# EAGLE design placa_PM (EAGLE 9.6.2)
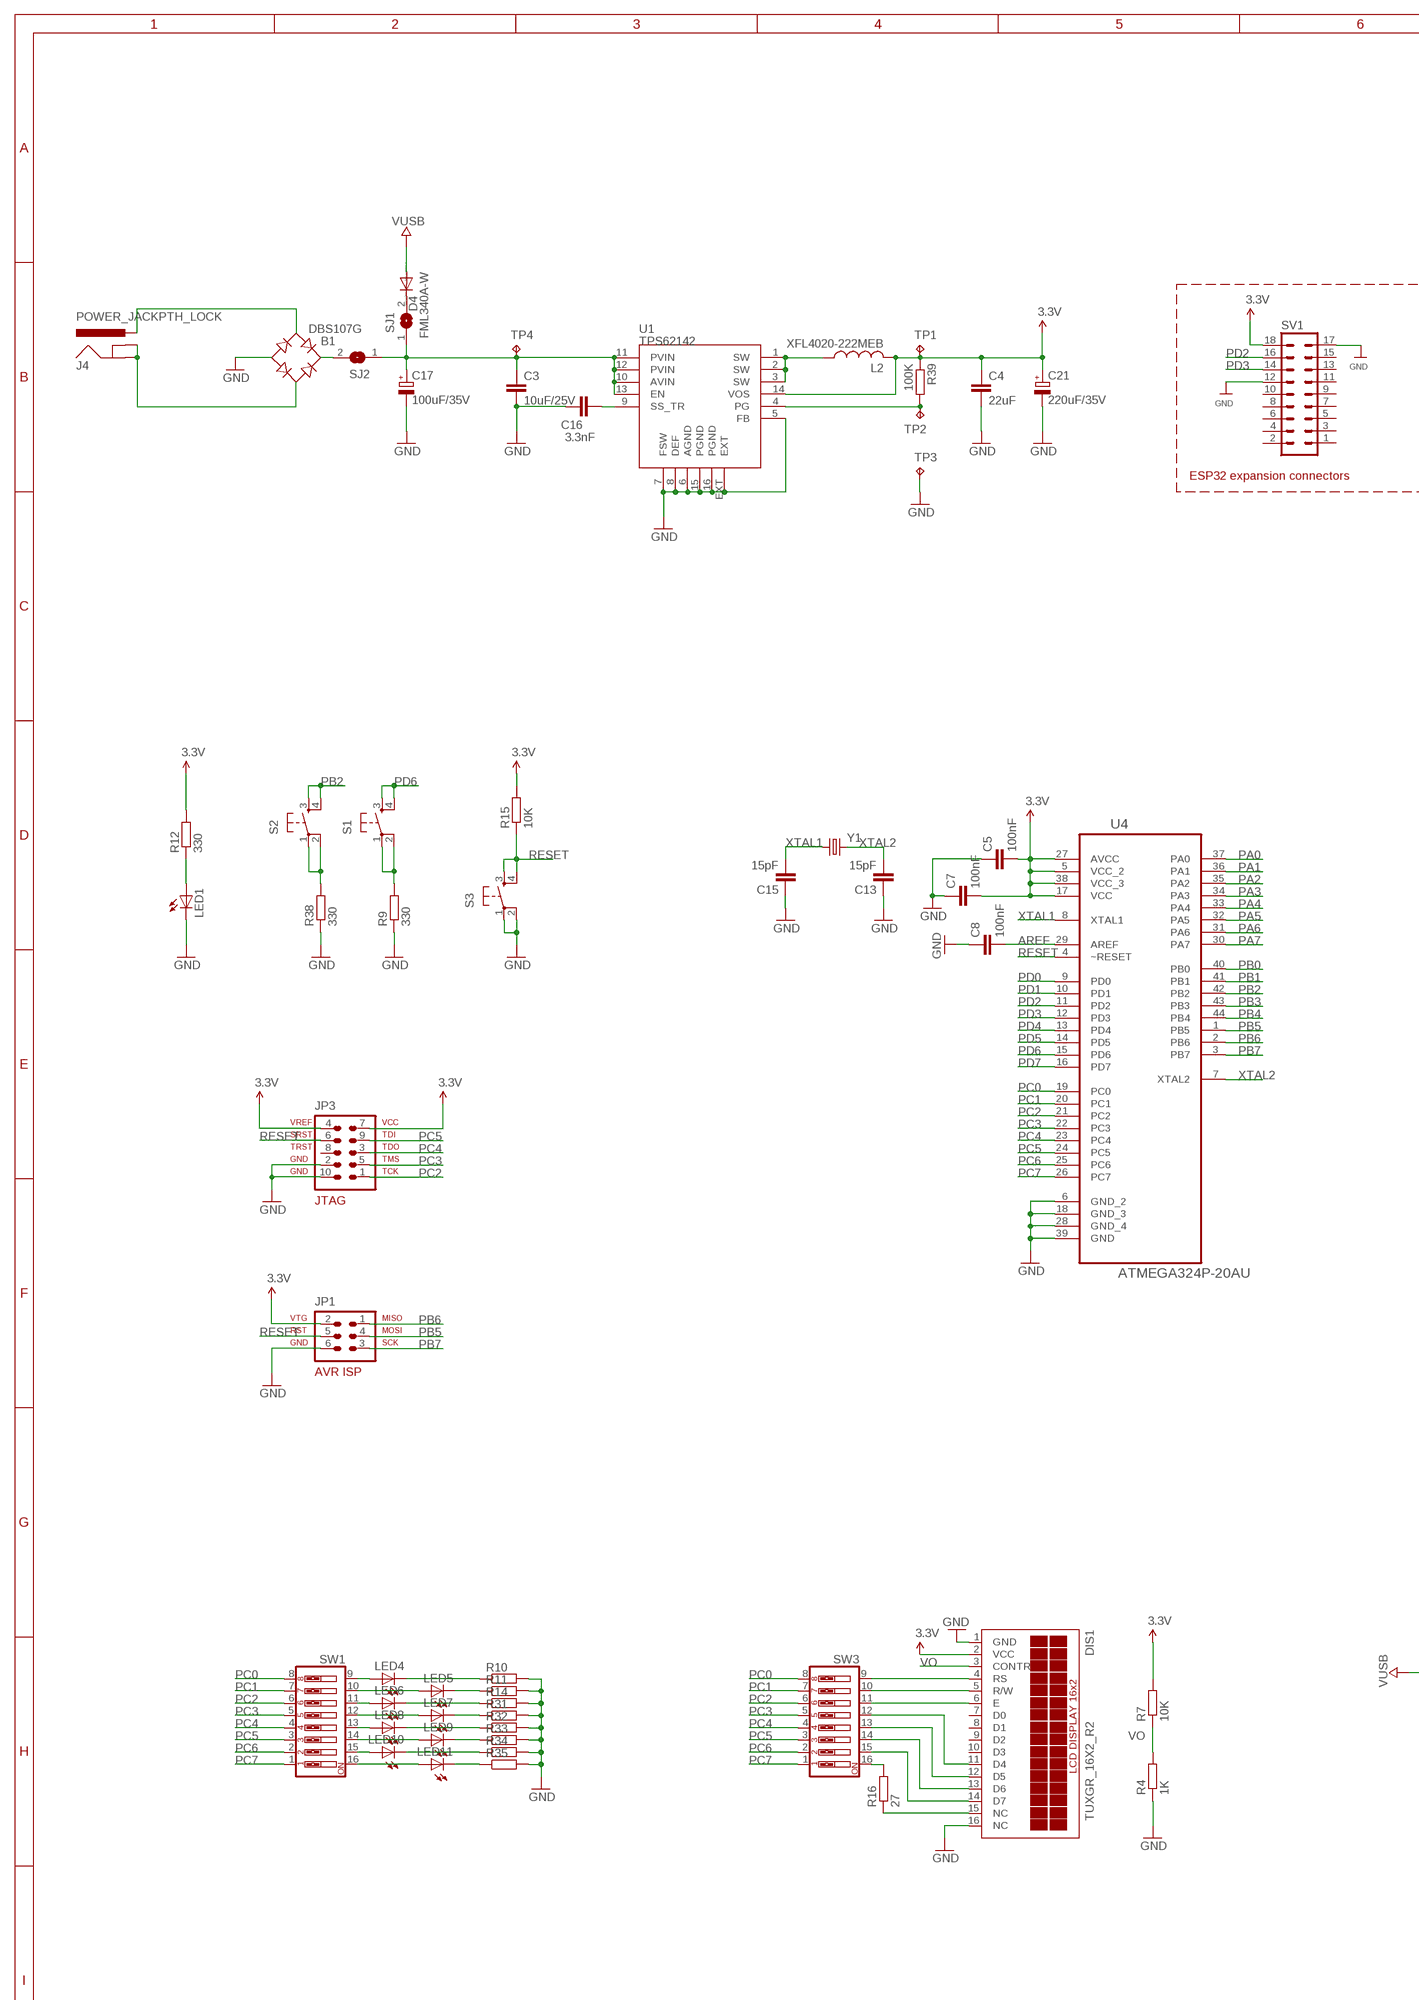
[diagram p0: schematic, sheet 1, part 1 of 2]
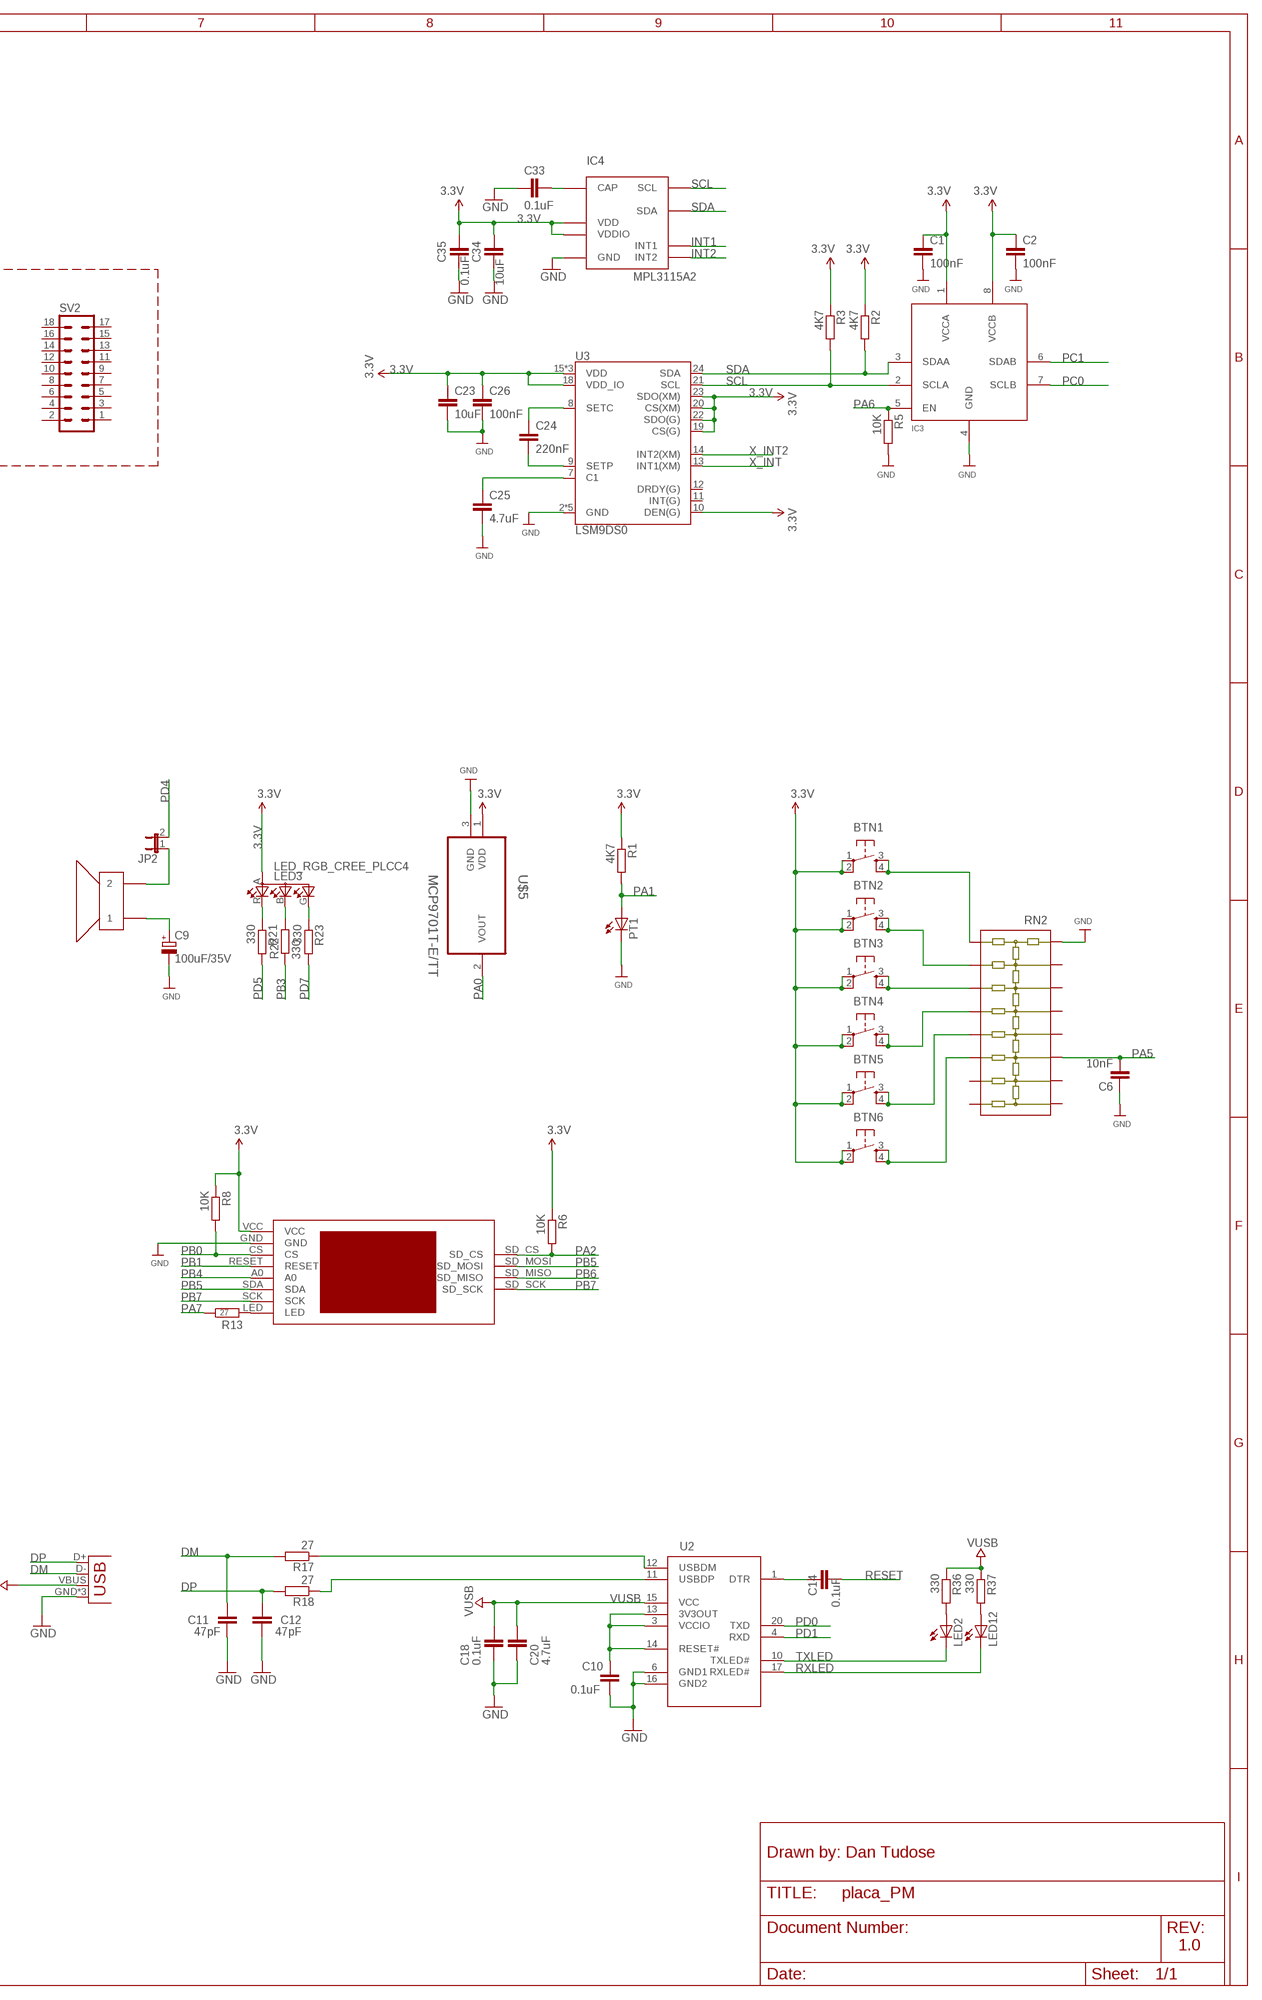
[diagram p1: schematic, sheet 1, part 2 of 2]

## Parts
B1  DBS107G  [DBS]
BTN1  TAC_SWITCHPTH  [TACTILE-PTH]
BTN2  TAC_SWITCHPTH  [TACTILE-PTH]
BTN3  TAC_SWITCHPTH  [TACTILE-PTH]
BTN4  TAC_SWITCHPTH  [TACTILE-PTH]
BTN5  TAC_SWITCHPTH  [TACTILE-PTH]
BTN6  TAC_SWITCHPTH  [TACTILE-PTH]
C1  100nF  C-EUC0402  [C0402]
C2  100nF  C-EUC0402  [C0402]
C3  10uF/25V  C-EUC1210  [C1210]
C4  22uF  C-EUC1206  [C1206]
C5  100nF  C-EUC0402  [C0402]
C6  10nF  C-EUC0402  [C0402]
C7  100nF  C-EUC0402  [C0402]
C8  100nF  C-EUC0402  [C0402]
C9  100uF/35V  CPOL-EUUD-6,3X7,7  [UD-6,3X7,7_NICHICON]
C10  0.1uF  C-EUC0402  [C0402]
C11  47pF  C-EUC0402  [C0402]
C12  47pF  C-EUC0402  [C0402]
C13  15pF  C-EUC0402  [C0402]
C14  0.1uF  C-EUC0402  [C0402]
C15  15pF  C-EUC0402  [C0402]
C16  3.3nF  C-EUC0603  [C0603]
C17  100uF/35V  CPOL-EUUD-6,3X7,7  [UD-6,3X7,7_NICHICON]
C18  0.1uF  C-EUC0402  [C0402]
C20  4.7uF  C-EUC0603  [C0603]
C21  220uF/35V  CPOL-EUUD-6,3X7,7  [UD-6,3X7,7_NICHICON]
C23  10uF  C-EUC0402  [C0402]
C24  220nF  C-EUC0402  [C0402]
C25  4.7uF  C-EUC0603  [C0603]
C26  100nF  C-EUC0402  [C0402]
C33  0.1uF  CAP0402-CAP  [0402-CAP]
C34  10uF  CAP0402-CAP  [0402-CAP]
C35  0.1uF  CAP0402-CAP  [0402-CAP]
D4  FML340A-W  DIODE-DO-214AC  [DO-214AC]
DIS1  TUXGR_16X2_R2  [TUXGR_16X2_R2]
IC3  TCA9803VSS  [VSSOP8]
IC4  MPL3115A2  [LGA8R125P0X4_500X300X120]
J3  USBPTH  [USB-B-PTH]
J4  POWER_JACKPTH_LOCK  [POWER_JACK_PTH_LOCK]
JP1  AVR-ISP-6  [AVR-ISP-6]
JP2  JP1E  [JP1]
JP3  AVR-JTAG-10  [AVR-JTAG-10]
L2  XFL4020-222MEB  XFL4020  [XFL4020]
LED1  LEDCHIPLED_0603  [CHIPLED_0603]
LED2  LEDCHIP-LED0603  [CHIP-LED0603]
LED3  LED_RGB_CREE_PLCC4  [P-LCC-4-4]
LED4  LEDCHIP-LED0603  [CHIP-LED0603]
LED5  LEDCHIP-LED0603  [CHIP-LED0603]
LED6  LEDCHIP-LED0603  [CHIP-LED0603]
LED7  LEDCHIP-LED0603  [CHIP-LED0603]
LED8  LEDCHIP-LED0603  [CHIP-LED0603]
LED9  LEDCHIP-LED0603  [CHIP-LED0603]
LED10  LEDCHIP-LED0603  [CHIP-LED0603]
LED11  LEDCHIP-LED0603  [CHIP-LED0603]
LED12  LEDCHIP-LED0603  [CHIP-LED0603]
PT1  LEDSML0805  [SML0805]
R1  4K7  R-EU_R0402  [R0402]
R2  4K7  R-EU_R0402  [R0402]
R3  4K7  R-EU_R0402  [R0402]
R4  1K  R-EU_R0402  [R0402]
R5  10K  R-EU_R0402  [R0402]
R6  10K  R-EU_R0402  [R0402]
R7  10K  R-EU_R0402  [R0402]
R8  10K  R-EU_R0402  [R0402]
R9  330  R-EU_R0402  [R0402]
R10  R-EU_R0402  [R0402]
R11  R-EU_R0402  [R0402]
R12  330  R-EU_R0402  [R0402]
R13  27  R-EU_R0603  [R0603]
R14  R-EU_R0402  [R0402]
R15  10K  R-EU_R0402  [R0402]
R16  27  R-EU_R0603  [R0603]
R17  27  R-EU_R0603  [R0603]
R18  27  R-EU_R0603  [R0603]
R21  330  R-EU_R0402  [R0402]
R22  330  R-EU_R0402  [R0402]
R23  330  R-EU_R0402  [R0402]
R31  R-EU_R0402  [R0402]
R32  R-EU_R0402  [R0402]
R33  R-EU_R0402  [R0402]
R34  R-EU_R0402  [R0402]
R35  R-EU_R0402  [R0402]
R36  330  R-EU_R0402  [R0402]
R37  330  R-EU_R0402  [R0402]
R38  330  R-EU_R0402  [R0402]
R39  100K  R-EU_R0402  [R0402]
RN2  4816P-R2R  [4816P]
S1  TAC_SWITCHPTH  [TACTILE-PTH]
S2  TAC_SWITCHPTH  [TACTILE-PTH]
S3  TAC_SWITCHPTH  [TACTILE-PTH]
SJ1  SJ  [SJ]
SJ2  SJ  [SJ]
SV1  MA09-2  [MA09-2]
SV2  MA09-2  [MA09-2]
SW1  SW_DIP-8  [EDG-08]
SW3  SW_DIP-8  [EDG-08]
TP1  TPB1,27  [B1,27]
TP2  TPB1,27  [B1,27]
TP3  TPB1,27  [B1,27]
TP4  TPB1,27  [B1,27]
U1  TPS62142  TPS6214X""  [QFN16-3X3MM_1:1_V03]
U2  FT231XS  [SSOP20]
U3  LSM9DS0  [LGA-24]
U4  ATMEGA324P-20AU  [QFP80P1200X1200X120-44N]
U$5  MCP9701T-E/TT  [SOT95P237X112-3N]
U$6  CVS-3108  SPEAKER  [SPK]
U$8  LCD128X160  [LCD128X160]
Y1  CRYSTAL5X3  [CRYSTAL-SMD-5X3]

## Nets
3.3V: BTN1.1 BTN1.2 BTN2.1 BTN2.2 BTN3.1 BTN3.2 BTN4.1 BTN4.2 BTN5.1 BTN5.2 BTN6.1 BTN6.2 C1.1 C2.1 C4.1 C5.2 C7.2 C21.+ C23.1 C26.1 C34.2 C35.2 DIS1.2(VCC) IC3.1(VCCA) IC3.8(VCCB) IC4.1(VDD) IC4.4(VDDIO) JP1.2 JP3.4 JP3.7 L2.P$2 LED3.A(A2) R1.1 R2.1 R3.1 R6.1 R7.2 R8.1 R12.2 R15.2 R39.1 SV1.18 TP1.TP U1.14(VOS) U3.10(DEN(G)) U3.15(VDD) U3.16(VDD) U3.17(VDD) U3.18(VDD_IO) U3.19(CS(G)) U3.20(CS(XM)) U3.22(SDO(G)) U3.23(SDO(XM)) U4.5(VCC_2) U4.17(VCC) U4.27(AVCC) U4.38(VCC_3) U$5.1(VDD) U$8.VCC
AREF: C8.2 U4.29(AREF)
DM: C11.2 J3.D- R17.2
DP: C12.2 J3.D+ R18.2
GND: B1.- C1.2 C2.2 C3.2 C4.2 C5.1 C6.1 C7.1 C8.1 C9.- C10.2 C11.1 C12.1 C13.1 C15.1 C16.1 C17.- C18.2 C20.2 C21.- C23.2 C25.2 C26.2 C33.1 C34.1 C35.1 DIS1.1(GND) DIS1.16(NC) IC3.4(GND) IC4.3(GND) J3.GND J3.P$1(GND) J3.P$2(GND) JP1.6 JP3.2 JP3.10 LED1.C PT1.C R4.1 R5.2 R9.1 R10.2 R11.2 R14.2 R31.2 R32.2 R33.2 R34.2 R35.2 R38.1 RN2.9 S3.1 S3.2 SV1.12 SV1.17 TP3.TP U1.5(FB) U1.6(AGND) U1.7(FSW) U1.8(DEF) U1.15(PGND) U1.16(PGND) U1.EXT U2.6(GND1) U2.16(GND2) U3.2(GND) U3.3(GND) U3.4(GND) U3.5(GND) U3.6(GND) U4.6(GND_2) U4.18(GND_3) U4.28(GND_4) U4.39(GND) U$5.3(GND) U$8.GND
INT1: IC4.6(INT1)
INT2: IC4.5(INT2)
N$1: BTN1.3 BTN1.4 RN2.8
N$2: LED1.A R12.1
N$3: JP2.1 U$6.P$2
N$4: BTN2.3 BTN2.4 RN2.7
N$5: DIS1.4(RS) SW3.9
N$6: C9.+ U$6.P$1
N$7: DIS1.5(R/W) SW3.10
N$8: DIS1.15(NC) R16.1
N$9: R38.2 S2.1 S2.2
N$10: D4.C SJ1.2
N$11: B1.AC1 J4.PWR
N$12: B1.AC2 J4.GND J4.GNDBREAK
N$13: C3.1 C17.+ SJ1.1 SJ2.1 TP4.TP U1.10(AVIN) U1.11(PVIN) U1.12(PVIN) U1.13(EN)
N$14: BTN3.3 BTN3.4 RN2.6
N$15: BTN4.3 BTN4.4 RN2.5
N$16: DIS1.6(E) SW3.11
N$17: R9.2 S1.1 S1.2
N$19: B1.+ SJ2.2
N$20: BTN5.3 BTN5.4 RN2.4
N$21: BTN6.3 BTN6.4 RN2.3
N$23: R13.2 U$8.LED
N$24: LED3.R(CRED) R21.1
N$25: LED3.B(CBLUE) R22.2
N$26: C14.1 U2.1(DTR)
N$27: C33.2 IC4.2(CAP)
N$28: LED3.G(CGREEN) R23.1
N$29: C24.1 U3.8(SETC)
N$30: C24.2 U3.9(SETP)
N$31: C25.1 U3.7(C1)
N$33: DIS1.11(D4) SW3.12
N$36: DIS1.12(D5) SW3.13
N$37: C16.2 U1.9(SS_TR)
N$38: DIS1.13(D6) SW3.14
N$39: DIS1.14(D7) SW3.15
N$40: R16.2 SW3.16
N$41: LED4.A SW1.9
N$42: LED6.A SW1.11
N$43: LED8.A SW1.13
N$44: LED10.A SW1.15
N$45: LED11.A SW1.16
N$46: LED9.A SW1.14
N$47: LED7.A SW1.12
N$48: LED5.A SW1.10
N$49: LED4.C R10.1
N$50: LED5.C R11.1
N$51: LED6.C R14.1
N$52: LED7.C R31.1
N$53: LED8.C R32.1
N$54: LED9.C R33.1
N$55: LED10.C R34.1
N$56: LED11.C R35.1
N$57: C10.1 U2.3(VCCIO) U2.13(3V3OUT) U2.14(RESET#)
N$58: R17.1 U2.12(USBDM)
N$59: R18.1 U2.11(USBDP)
N$60: LED2.A R36.2
N$61: LED12.A R37.2
N$65: L2.P$1 U1.1(SW) U1.2(SW) U1.3(SW)
N$67: R39.2 TP2.TP U1.4(PG)
PA0: U4.37(PA0) U$5.2(VOUT)
PA1: PT1.A R1.2 U4.36(PA1)
PA2: R6.2 U4.35(PA2) U$8.SD_CS
PA3: U4.34(PA3)
PA4: U4.33(PA4)
PA5: C6.2 RN2.14 U4.32(PA5)
PA6: IC3.5(EN) R5.1 U4.31(PA6)
PA7: R13.1 U4.30(PA7)
PB0: R8.2 U4.40(PB0) U$8.CS
PB1: U4.41(PB1) U$8.RESET
PB2: S2.3 S2.4 U4.42(PB2)
PB3: R22.1 U4.43(PB3)
PB4: U4.44(PB4) U$8.A0
PB5: JP1.4 U4.1(PB5) U$8.SD_MOSI U$8.SDA
PB6: JP1.1 U4.2(PB6) U$8.SD_MISO
PB7: JP1.3 U4.3(PB7) U$8.SCK U$8.SD_SCK
PC0: IC3.7(SCLB) SW1.8 SW3.8 U4.19(PC0)
PC1: IC3.6(SDAB) SW1.7 SW3.7 U4.20(PC1)
PC2: JP3.1 SW1.6 SW3.6 U4.21(PC2)
PC3: JP3.5 SW1.5 SW3.5 U4.22(PC3)
PC4: JP3.3 SW1.4 SW3.4 U4.23(PC4)
PC5: JP3.9 SW1.3 SW3.3 U4.24(PC5)
PC6: SW1.2 SW3.2 U4.25(PC6)
PC7: SW1.1 SW3.1 U4.26(PC7)
PD0: U2.20(TXD) U4.9(PD0)
PD1: U2.4(RXD) U4.10(PD1)
PD2: SV1.16 U4.11(PD2)
PD3: SV1.14 U4.12(PD3)
PD4: JP2.2 U4.13(PD4)
PD5: R21.2 U4.14(PD5)
PD6: S1.3 S1.4 U4.15(PD6)
PD7: R23.2 U4.16(PD7)
RESET: C14.2 JP1.5 JP3.6 R15.1 S3.3 S3.4 U4.4(~RESET)
RXLED: LED12.C U2.17(RXLED#)
SCL: IC3.2(SCLA) IC4.8(SCL) R3.2 U3.21(SCL)
SDA: IC3.3(SDAA) IC4.7(SDA) R2.2 U3.24(SDA)
TXLED: LED2.C U2.10(TXLED#)
VO: DIS1.3(CONTR) R4.2 R7.1
VUSB: C18.1 C20.1 D4.A J3.VBUS R36.1 R37.1 U2.15(VCC)
X_INT: U3.13(INT1(XM))
X_INT2: U3.14(INT2(XM))
XTAL1: C15.2 U4.8(XTAL1) Y1.1
XTAL2: C13.2 U4.7(XTAL2) Y1.3
Unconnected: DIS1.7(D0) DIS1.8(D1) DIS1.9(D2) DIS1.10(D3) JP3.8 RN2.1 RN2.2 RN2.10 RN2.11 RN2.12 RN2.13 RN2.15 RN2.16 SV1.1 SV1.2 SV1.3 SV1.4 SV1.5 SV1.6 SV1.7 SV1.8 SV1.9 SV1.10 SV1.11 SV1.13 SV1.15 SV2.1 SV2.2 SV2.3 SV2.4 SV2.5 SV2.6 SV2.7 SV2.8 SV2.9 SV2.10 SV2.11 SV2.12 SV2.13 SV2.14 SV2.15 SV2.16 SV2.17 SV2.18 U3.11(INT(G)) U3.12(DRDY(G))

## Notes on the sheet
- ESP32 expansion connectors
- Drawn by: Dan Tudose
- 1.0

## Library data of the parts
B1 = rectifier:DB?*G: Single Phase 1.0 AMP Glass Passivated Bridge Rectifier Taiwan Semiconductor Co.,Ltd. - TSC Source: http://www.taiwansemi.com/TSCbig5/ezcatfiles/cust/img/img/db101g.pdf http://www.ts.com.tw/db/pictures/modules/PDT/PDT060207001/DBLS201G.pdf
BTN1-BTN6 S1-S3 = SparkFun:TAC_SWITCH: Momentary Switch Button commonly used for reset or general input. Spark Fun Electronics SKU : COM-00097
C1 C2 C5-C8 C13 C15 C23-C26 = rcl@1:C-EU: CAPACITOR, European symbol
C3 = rcl:C-EU: CAPACITOR, European symbol; TYPE: TMK325BJ106KM-P
C4 C16 = rcl:C-EU: CAPACITOR, European symbol
C9 C17 C21 = rcl:CPOL-EU: POLARIZED CAPACITOR, European symbol; CODE: UUR1V101MCL6GS
C10-C12 C14 C18 C20 = resistor:C-EU: CAPACITOR, European symbol
C33-C35 = SparkFun-Passives:CAP: Capacitor Standard 0603 ceramic capacitor, and 0.1" leaded capacitor.
D4 = diode@1:DIODE-: DIODE
DIS1 = display-lcd:TUXGR_16X2_R2: Tuxgraphics LCD display 16x2 characters reflective, without background light Source: tuxgr_12x2_r2.pdf; OC_FARNELL: unknown; OC_NEWARK: unknown
IC3 = dan:TCA9803
IC4 = Freescale_By_element14_Batch_1:MPL3115A2
J3 = 0andrei_custom:USB: USB Connectors USB-B-PTH is fully proven SKU : PRT-00139 USB-miniB is fully proven SKU : PRT-00587 USB-A-PCB is untested. USB-A-H is throughly reviewed, but untested. Spark Fun Electronics SKU : PRT-00437 USB-B-SMT is throughly reviewed, but untested. Needs silkscreen touching up. USB-A-S has not been used/tested USB-MB-H has not been used/tested
J4 = SparkFun-Connectors:POWER_JACK: Power Jack This is the standard 5.5mm barrel jack for power. The PTH is the most common, proven, reliable, footprint. The Slot footprint only works if the mill layer is transmitted to the PCB fab house so be warned. Spark Fun Electronics SKU : PRT-00119 SMT: CONN-08106 Mating wall wart : TOL-00298 (and others)
JP1 = 0andrei_custom:AVR-ISP-6: AVR ISP-6 Serial Programming Header
JP2 = jumper:JP1E: JUMPER
JP3 = avr-7:AVR-JTAG-10: AVR JTAG Debug/Programming Header
L2 = XFL4020:XFL4020: Coilcraft shielded 4x4mm high temperature inductor
LED1 PT1 = led:LED: LED
LED2 LED4-LED12 = adafruit:LED: LED
LED3 = led:LED_RGB_CREE_PLCC4
R1-R3 R5 R6 R8 R21-R23 = rcl@1:R-EU_: RESISTOR, European symbol
R4 R7 R9 R12 R13 R15 R16 R38 R39 = 0andrei_custom:R-EU_: RESISTOR, European symbol
R10 R11 R14 R31-R35 = rcl:R-EU_: RESISTOR, European symbol
R17 R18 R36 R37 = resistor:R-EU_: RESISTOR, European symbol
RN2 = resistor-bourns:4816P-R2R
SJ1 SJ2 = jumper:SJ: SMD solder JUMPER
SV1 SV2 = con-lstb:MA09-2: PIN HEADER; OC_FARNELL: unknown; OC_NEWARK: unknown
SW1 SW3 = special:SW_DIP-8: DIP SWITCH
TP1-TP4 = testpad:TP: Test pad
U1 = SparkFun-PowerIC:TPS6214X: 3-17V, 2A Step Down Converter
U2 = 0andrei_custom:FT231XS
U3 = SparkFun-DigitalIC:LSM9DS0: LSM9DS0 3D Accelerometer, 3D Gyroscope, 3D Magnetomter Features: 3 acceleration channels, 3 angular rate channels, 3 magnetic field channels ±2/±4/±6/±8/±16 g linear acceleration full scale ±2/±4/±8/±12 gauss magnetic full scale ±245/±500/±2000 dps angular rate full scale 16-bit data output SPI / I2C serial interfaces Analog supply voltage 2.4 V to 3.6 V Power-down mode / low-power mode Programmable interrupt generators Embedded self-test Embedded temperature sensor Embedded FIFO Position and motion detection functions Click/double-click recognition
U4 = Atmel_By_element14_Batch_1-00:ATMEGA324P-20AU: 8-bit Microcontroller with 16K/32K/64K Bytes In-System Programmable Flash; MPN: ATMEGA324P-20AU; OC_FARNELL: 1455109; OC_NEWARK: 58M3735; PACKAGE: TQFP-44; SUPPLIER: Atmel
U$5 = Microchip_By_element14_Batch_1:MCP9701T-E/TT: Low-Power Linear Active Thermistor; MPN: MCP9701T-E/TT; OC_FARNELL: 1834865; OC_NEWARK: 58T3403; PACKAGE: SOT-3; SUPPLIER: MICROCHIP
U$6 = dan:SPEAKER
U$8 = dan:LCD128X160
Y1 = SparkFun-FreqCtrl:CRYSTAL: Various standard crystals. Proven footprints. Spark Fun Electronics SKU : COM-00534

## Net classes
1 power: width 0.61 mm
2 gnd: width 0.254 mm, drill 0.61 mm, clearance 0.254 mm

## Board
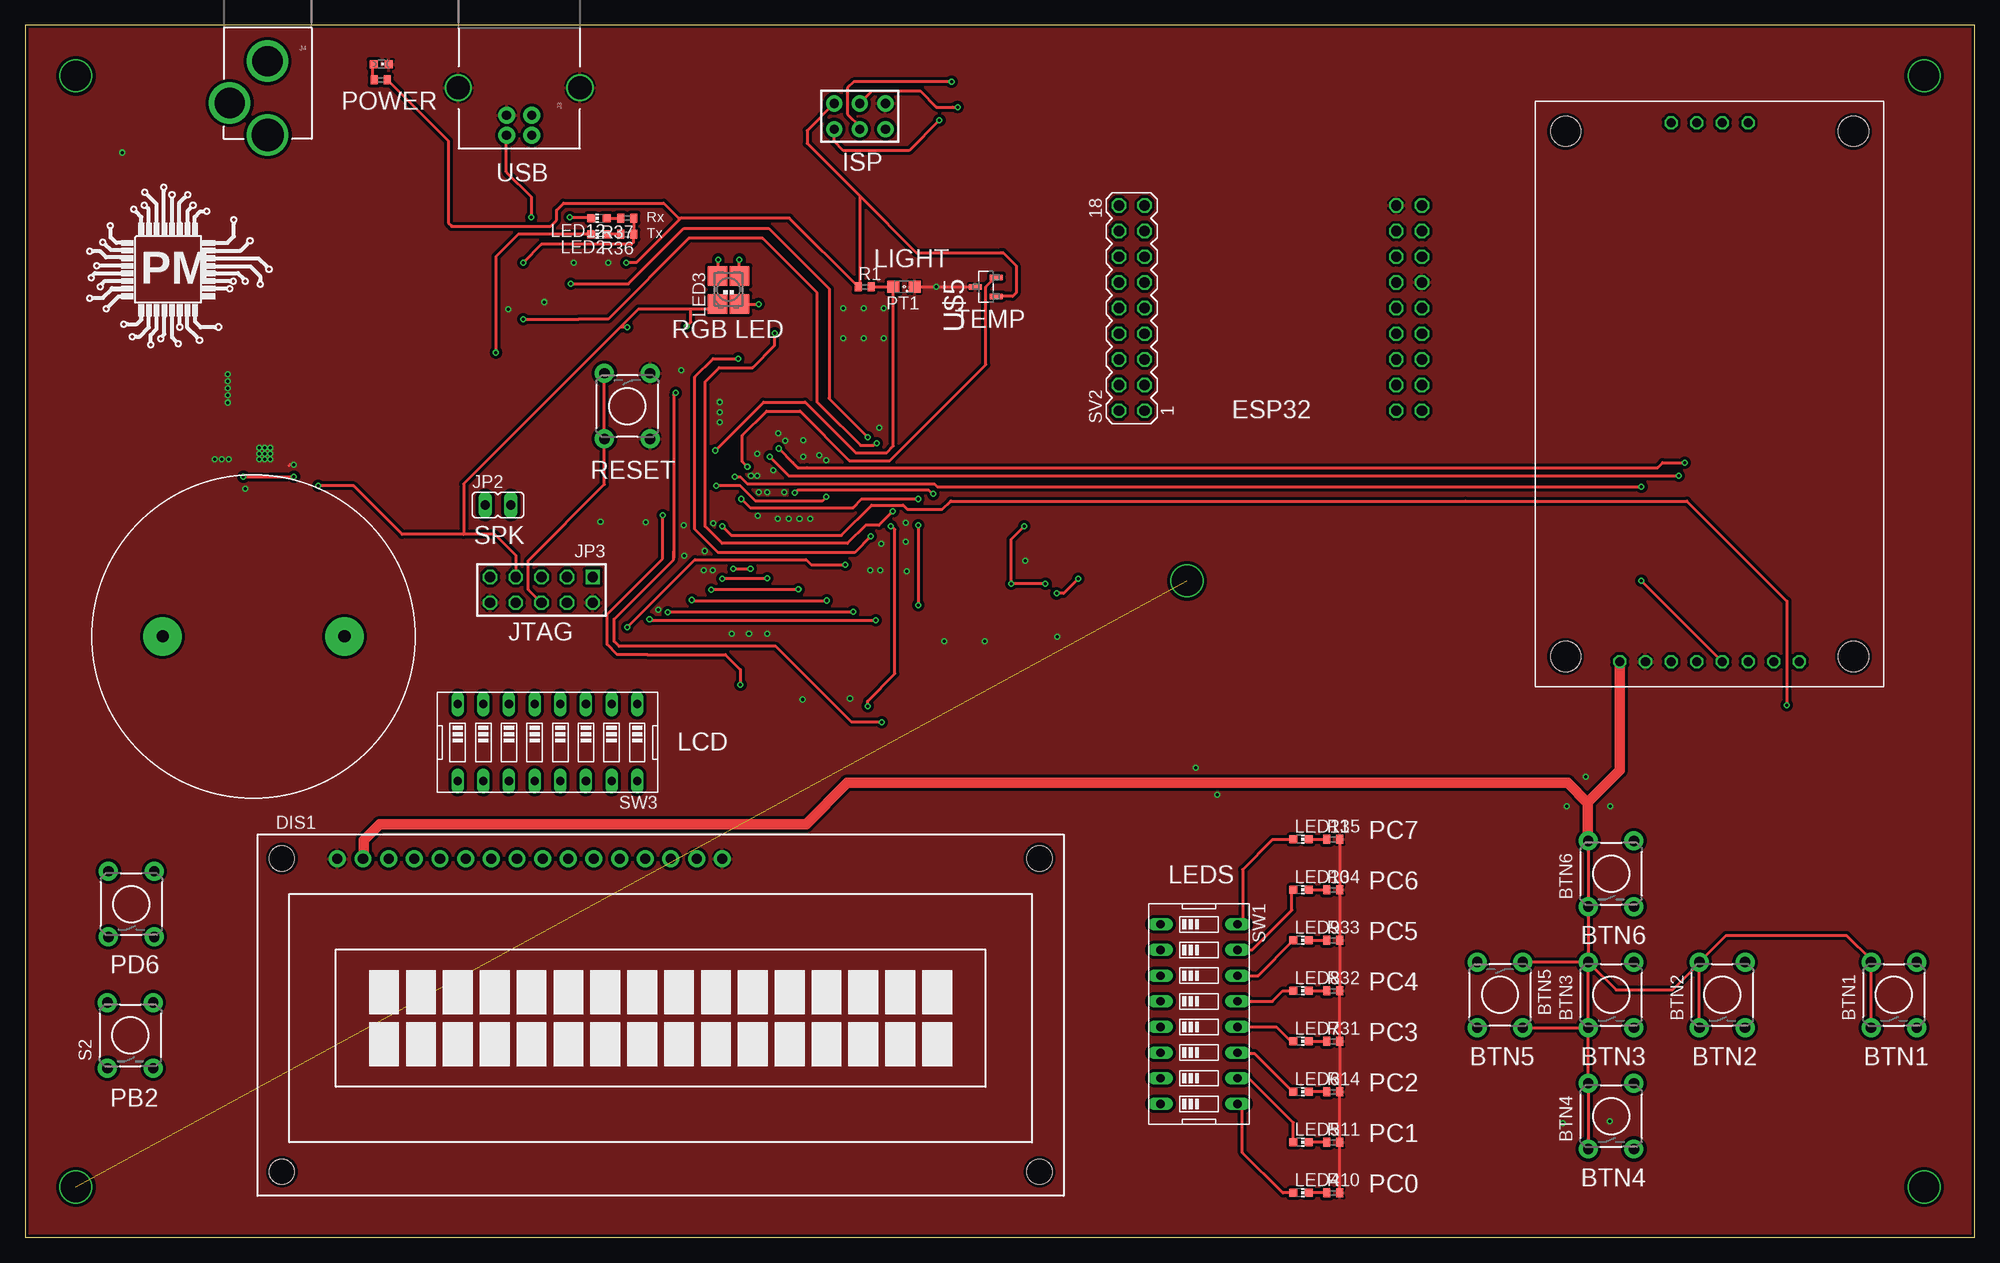
[diagram p2: board, top side]
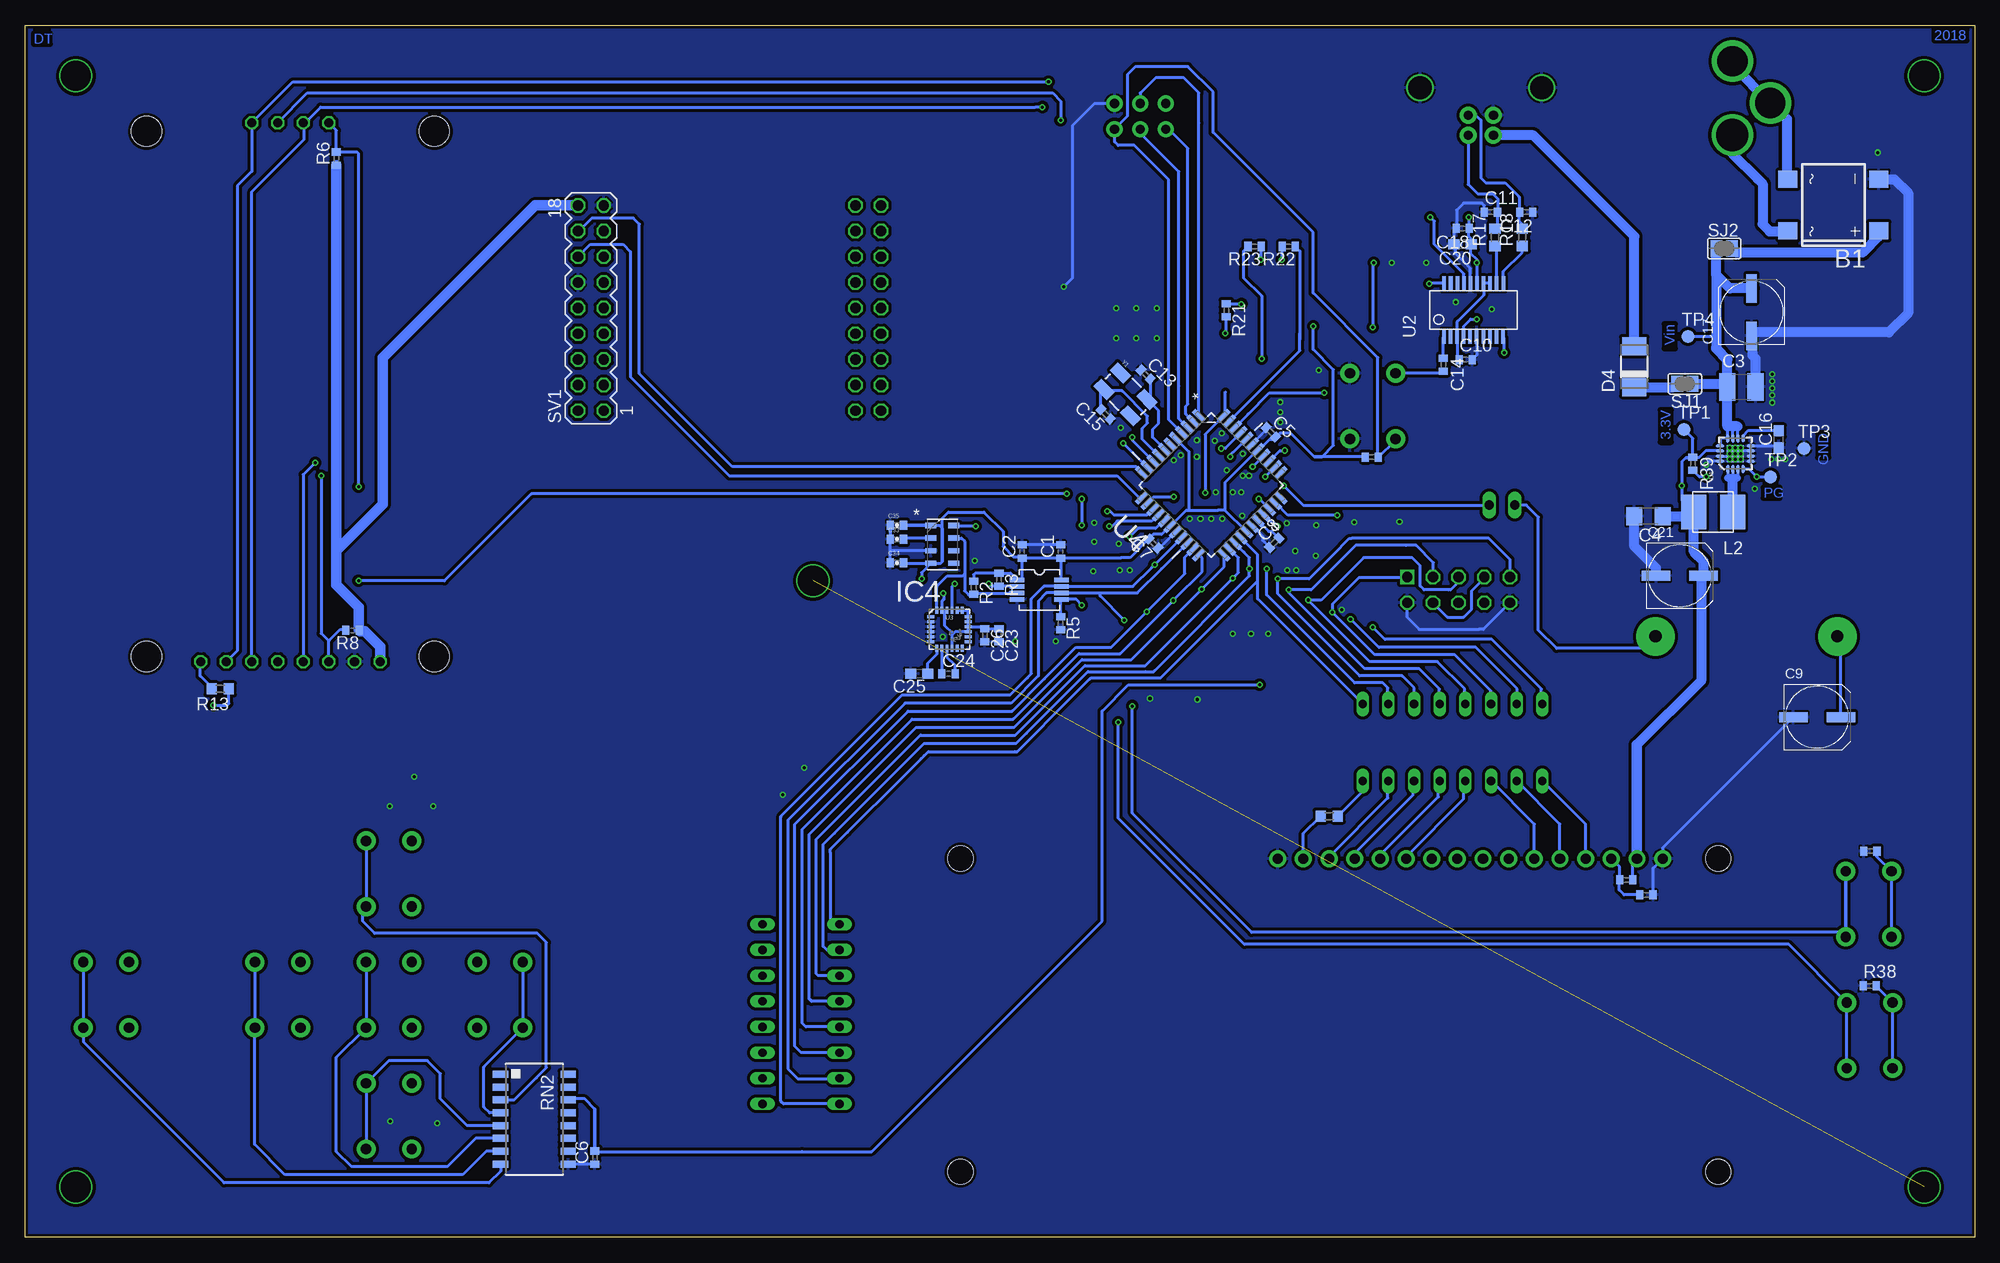
[diagram p3: board, bottom side, seen from below]

Size 193 x 120 mm. Coordinates in mm from the lower left corner, seen from the top.
Outline: 0,0 193,0 193,120 0,120 0,0
Copper layers (1*16): Top 0.035mm / dielectric 1.5mm / Bottom 0.035mm
Design rules "default": minimum track width 0.15mm, minimum drill 0.3mm, track to track 0.15mm, track to pad 0.15mm, pad to pad 0.15mm, via to via 0.15mm, smd to smd 0.15mm, copper to edge 0.3mm, drill to drill 0.2mm, minimum pad ring 0.2mm, minimum via ring 0.15mm, stop-mask expansion 0.075mm, vias tented up to drill 12mil, thermal gap 0.2mm

### Footprints (pad centres in the part's own frame; a part is rotated, then mirrored left to right if it is on the bottom)
DBS = smd 1.7 x 1.9: + -2.55,-4.5; - 2.55,-4.5; AC1 -2.55,4.5; AC2 2.55,4.5
TACTILE-PTH = drill 1.016 pad 1.88: 1 -3.251,2.261; 2 3.251,2.261; 3 -3.251,-2.261; 4 3.251,-2.261
C0402 = smd 0.7 x 0.9: 1 -0.65,0; 2 0.65,0
C1210 = smd 1.6 x 2.7: 1 -1.4,0; 2 1.4,0
C1206 = smd 1.6 x 1.8: 1 -1.4,0; 2 1.4,0
UD-6,3X7,7_NICHICON = smd 2.8 x 1: + 2.35,0; - -2.35,0
C0603 = smd 1.1 x 1: 1 -0.85,0; 2 0.85,0
0402-CAP = smd 0.7 x 0.9: 1 -0.65,0; 2 0.65,0
DO-214AC = smd 1.8 x 2.4: A 2.025,0; C -2.025,0
TUXGR_16X2_R2 = drill 1 pad 1.676: 1 -32,15.5; 2 -29.46,15.5; 3 -26.92,15.5; 4 -24.38,15.5; 5 -21.84,15.5; 6 -19.3,15.5; 7 -16.76,15.5; 8 -14.22,15.5; 9 -11.68,15.5; 10 -9.14,15.5; 11 -6.6,15.5; 12 -4.06,15.5; 13 -1.52,15.5; 14 1.02,15.5; 15 3.56,15.5; 16 6.1,15.5 | hole 2.5: -37.5,-15.5; 37.5,-15.5; -37.5,15.5; 37.5,15.5
VSSOP8 = smd 0.45 x 1.45: 1 -1,-2.2; 2 -0.35,-2.2; 3 0.3,-2.2; 4 0.95,-2.2; 5 0.95,2.2; 6 0.3,2.2; 7 -0.35,2.2; 8 -1,2.2
LGA8R125P0X4_500X300X120 = smd 1.092 x 0.508: 1 -1.143,1.88; 2 -1.143,0.635; 3 -1.143,-0.635; 4 -1.143,-1.88; 5 1.143,-1.88; 6 1.143,-0.635; 7 1.143,0.635; 8 1.143,1.88
USB-B-PTH = drill 0.914 pad 1.676: D+ 0,1.25; D- 1.981,1.25; GND 0,-1.25; VBUS 1.981,-1.25 | drill 2.286: P$1 -2.718,-6.02; P$2 -2.718,6.02
POWER_JACK_PTH_LOCK = drill 2.997 pad 4.115: GND 0.025,6.557; GNDBREAK 3.762,10.7 | drill 3.2 pad 4.115: PWR 0,13.878
AVR-ISP-6 = drill 0.9 pad 1.6: 1 -2.54,-1.27; 2 -2.54,1.27; 3 0,-1.27; 4 0,1.27; 5 2.54,-1.27; 6 2.54,1.27
JP1 = drill 0.914 long: 1 0,-1.27; 2 0,1.27
AVR-JTAG-10 = drill 1.016 square: 1 -5.08,-1.27 | drill 1.016 octagon: 2 -5.08,1.27; 3 -2.54,-1.27; 4 -2.54,1.27; 5 0,-1.27; 6 0,1.27; 7 2.54,-1.27; 8 2.54,1.27; 9 5.08,-1.27; 10 5.08,1.27
XFL4020 = smd 2.48 x 3.4: P$1 -1.93,0; P$2 1.93,0
CHIPLED_0603 = smd 0.8 x 0.8: A 0,-0.75; C 0,0.75
CHIP-LED0603 = smd 0.8 x 0.8: A 0,-0.75; C 0,0.75
P-LCC-4-4 = smd 1.93 x 1.93: A -1.088,-1.39; B -1.063,1.39; G 1.113,1.39; R 1.113,-1.39
SML0805 = smd 1.2 x 1.2: A 1.05,0; C -1.05,0
R0402 = smd 0.7 x 0.9: 1 -0.65,0; 2 0.65,0
R0603 = smd 1 x 1.1: 1 -0.85,0; 2 0.85,0
4816P = smd 0.7 x 1.5: 1 -4.445,-3.346; 2 -3.175,-3.346; 3 -1.905,-3.346; 4 -0.635,-3.346; 5 0.635,-3.346; 6 1.905,-3.346; 7 3.175,-3.346; 8 4.445,-3.346; 9 4.445,3.346; 10 3.175,3.346; 11 1.905,3.346; 12 0.635,3.346; 13 -0.635,3.346; 14 -1.905,3.346; 15 -3.175,3.346; 16 -4.445,3.346
SJ = smd 1.168 x 1.6: 1 -0.762,0; 2 0.762,0
MA09-2 = drill 1.016 octagon: 1 -10.16,-1.27; 2 -10.16,1.27; 3 -7.62,-1.27; 4 -7.62,1.27; 5 -5.08,-1.27; 6 -5.08,1.27; 7 -2.54,-1.27; 8 -2.54,1.27; 9 0,-1.27; 10 0,1.27; 11 2.54,-1.27; 12 2.54,1.27; 13 5.08,-1.27; 14 5.08,1.27; 15 7.62,-1.27; 16 7.62,1.27; 17 10.16,-1.27; 18 10.16,1.27
EDG-08 = drill 0.813 long: 1 -8.89,-3.81; 2 -6.35,-3.81; 3 -3.81,-3.81; 4 -1.27,-3.81; 5 1.27,-3.81; 6 3.81,-3.81; 7 6.35,-3.81; 8 8.89,-3.81; 9 8.89,3.81; 10 6.35,3.81; 11 3.81,3.81; 12 1.27,3.81; 13 -1.27,3.81; 14 -3.81,3.81; 15 -6.35,3.81; 16 -8.89,3.81
B1,27 = smd 1.27 x 1.27: TP 0,0
QFN16-3X3MM_1:1_V03 = smd 0.85 x 0.28: 1 -1.524,0.75; 2 -1.524,0.253; 3 -1.529,-0.25; 4 -1.527,-0.774; 9 1.503,-0.77; 10 1.498,-0.245; 11 1.498,0.255; 12 1.495,0.755 | smd 0.28 x 0.85: 5 -0.765,-1.513; 6 -0.265,-1.513; 7 0.263,-1.513; 8 0.763,-1.513; 13 0.758,1.518; 14 0.258,1.518; 15 -0.247,1.518; 16 -0.742,1.518 | smd 1.68 x 1.68: EXT -0.009,0.008
SSOP20 = smd 0.348 x 1.397: 1 -2.955,-2.64; 2 -2.305,-2.64; 3 -1.655,-2.64; 4 -1.005,-2.64; 5 -0.355,-2.64; 6 0.295,-2.64; 7 0.945,-2.64; 8 1.595,-2.64; 9 2.245,-2.64; 10 2.895,-2.64; 11 2.925,2.64; 12 2.275,2.64; 13 1.625,2.64; 14 0.975,2.64; 15 0.325,2.64; 16 -0.325,2.64; 17 -0.975,2.64; 18 -1.625,2.64; 19 -2.275,2.64; 20 -2.925,2.64
LGA-24 = smd 0.7 x 0.29: 1 -1.875,1.25; 2 -1.875,0.75; 3 -1.875,0.25; 4 -1.875,-0.25; 5 -1.875,-0.75; 6 -1.875,-1.25; 13 1.875,-1.25; 14 1.875,-0.75; 15 1.875,-0.25; 16 1.875,0.25; 17 1.875,0.75; 18 1.875,1.25 | smd 0.29 x 0.7: 7 -1.25,-1.875; 8 -0.75,-1.875; 9 -0.25,-1.875; 10 0.25,-1.875; 11 0.75,-1.875; 12 1.25,-1.875; 19 1.25,1.875; 20 0.75,1.875; 21 0.25,1.875; 22 -0.25,1.875; 23 -0.75,1.875; 24 -1.25,1.875
QFP80P1200X1200X120-44N = smd 1.473 x 0.508: 1 -5.74,3.988; 2 -5.74,3.2; 3 -5.74,2.388; 4 -5.74,1.6; 5 -5.74,0.787; 6 -5.74,0; 7 -5.74,-0.787; 8 -5.74,-1.6; 9 -5.74,-2.388; 10 -5.74,-3.2; 11 -5.74,-3.988; 23 5.74,-3.988; 24 5.74,-3.2; 25 5.74,-2.388; 26 5.74,-1.6; 27 5.74,-0.787; 28 5.74,0; 29 5.74,0.787; 30 5.74,1.6; 31 5.74,2.388; 32 5.74,3.2; 33 5.74,3.988 | smd 0.508 x 1.473: 12 -3.988,-5.74; 13 -3.2,-5.74; 14 -2.388,-5.74; 15 -1.6,-5.74; 16 -0.787,-5.74; 17 0,-5.74; 18 0.787,-5.74; 19 1.6,-5.74; 20 2.388,-5.74; 21 3.2,-5.74; 22 3.988,-5.74; 34 3.988,5.74; 35 3.2,5.74; 36 2.388,5.74; 37 1.6,5.74; 38 0.787,5.74; 39 0,5.74; 40 -0.787,5.74; 41 -1.6,5.74; 42 -2.388,5.74; 43 -3.2,5.74; 44 -3.988,5.74
SOT95P237X112-3N = smd 0.559 x 1.27: 1 -0.94,-1.041; 2 0.94,-1.041; 3 0,1.041
SPK = drill 1.2 pad 3.81: P$1 0,9; P$2 0,-9
LCD128X160 = drill 0.9 octagon: A0 2.5,15.98; CS 2.5,21.06; GND 2.5,23.6; LED 2.5,8.36; RESET 2.5,18.52; SCK 2.5,10.9; SD_CS 55.84,21.06; SD_MISO 55.84,15.98; SD_MOSI 55.84,18.52; SD_SCK 55.84,13.44; SDA 2.5,13.44; VCC 2.5,26.14 | hole 3: 3,3; 55,3; 55,31.5; 3,31.5
CRYSTAL-SMD-5X3 = smd 1.9 x 1.1: 1 -1.85,-1.15; 2 1.85,-1.15; 3 1.85,1.15; 4 -1.85,1.15

### Placement (x,y rotation side)
B1  14,102.2 90 bottom
BTN1  185,24 90 top
BTN2  168,24 90 top
BTN3  157,24 90 top
BTN4  157,12 90 top
BTN5  146,24 270 top
BTN6  157,36 90 top
C1  90.5,67.9 90 bottom
C2  94.3,67.9 90 bottom
C3  23.1,84.2 0 bottom
C4  32.3,71.4 180 bottom
C5  69.68,79.71 315 bottom
C6  136.6,7.9 90 bottom
C7  81.3,68.69 135 bottom
C8  69.36,68.77 45 bottom
C9  15.6,51.5 0 bottom
C10  50.4,86.9 0 bottom
C11  47.9,101.5 0 bottom
C12  44.4,101.5 180 bottom
C13  82.09,85.42 315 bottom
C14  52.6,86.4 270 bottom
C15  86.04,81.49 135 bottom
C16  19.4,79 90 bottom
C17  22.1,91.6 90 bottom
C18  50.7,99.9 180 bottom
C20  50.7,98.3 180 bottom
C21  29.2,65.5 0 bottom
C23  96.6,59.6 270 bottom
C24  101.6,55.8 0 bottom
C25  104.5,55.8 180 bottom
C26  98,59.6 270 bottom
C33  106.7,69.1 0 bottom
C34  106.7,66.8 0 bottom
C35  106.7,70.5 0 bottom
D4  33.7,86.2 90 bottom
DIS1  62.9,22 0 top
IC3  92.6,64.1 270 bottom
IC4  102.2,68.6 0 bottom
J3  48.9,111.1 270 top
J4  24,123 180 top
JP1  82.62,110.99 0 top
JP2  46.8,72.5 270 top
JP3  51.1,64.1 180 top
L2  25.9,71.8 180 bottom
LED1  35.25,116.15 270 top
LED2  56.8,99.3 90 top
LED3  69.6,93.8 0 top
LED4  126.3,4.4 270 top
LED5  126.3,9.4 270 top
LED6  126.3,14.4 270 top
LED7  126.3,19.4 270 top
LED8  126.3,24.4 270 top
LED9  126.3,29.4 270 top
LED10  126.3,34.4 270 top
LED11  126.3,39.4 270 top
LED12  56.8,100.9 90 top
PT1  87,94.1 180 top
R1  83.1,94.1 0 top
R2  99.1,64.3 270 bottom
R3  96.6,65.1 270 bottom
R4  32.5,33.9 180 bottom
R5  90.5,60.8 270 bottom
R6  162.2,106.8 90 bottom
R7  34.5,35.4 0 bottom
R8  160.6,60.1 180 bottom
R9  10.33,38.24 0 bottom
R10  129.5,4.4 0 top
R11  129.5,9.4 0 top
R12  35.2,114.6 0 top
R13  173.7,54.3 180 bottom
R14  129.5,14.4 0 top
R15  59.68,77.24 180 bottom
R16  63.9,41.7 0 bottom
R17  47.5,99 90 bottom
R18  44.8,99 90 bottom
R21  74.1,91.8 270 bottom
R22  67.9,98.1 180 bottom
R23  71.3,98.1 180 bottom
R31  129.5,19.4 0 top
R32  129.5,24.4 0 top
R33  129.5,29.4 0 top
R34  129.5,34.4 0 top
R35  129.5,39.4 0 top
R36  59.6,99.3 180 top
R37  59.6,100.9 180 top
R38  10.4,24.9 0 bottom
R39  27.9,76.6 270 bottom
RN2  142.6,11.7 270 bottom
S1  10.5,33 90 top
S2  10.4,20 90 top
S3  59.6,82.3 270 top
SJ1  28.7,84.5 180 bottom
SJ2  24.8,97.9 0 bottom
SV1  137,92 90 bottom
SV2  109.54,92 90 top
SW1  116.2,22.1 270 top
SW3  51.7,49 180 top
TP1  28.8,80 0 bottom
TP2  20.2,75.3 0 bottom
TP3  16.9,78.1 0 bottom
TP4  28.4,89.2 0 bottom
U1  23.7,77.6 90 bottom
U2  49.6,91.8 0 bottom
U3  101.5,60.2 0 bottom
U4  75.59,74.47 315 bottom
U$5  95.1,94.1 90 top
U$6  22.6,59.5 90 top
U$8  184,54.5 90 top
Y1  84.07,83.46 315 bottom

### Tracks (layer width: path | path; a pad name or v marks a point on that pad's centre or on a via)
3.3V  (via drill 0.3)
  Top 0.3: JP3.7 48.6,65.41 48.6,67.5 46.5,69.6 43.4,69.6 | 43.4,69.6 37.3,69.6 32.5,74.4 v29,74.4 | JP1.2 77.4,109.58 77.4,108.3 82.65,103.05 | 82.65,103.05 88.2,97.5 96.6,97.5 96.8,97.5 98.1,96.2 98.1,93.5 97.76,93.16 U$5.1 | 82.65,103.05 82.65,94.3 R1.1 75.65,100.9 64.9,100.9 64.7,100.7 | LED3.A 68,91.9 65.9,91.9 | 65.9,91.9 61.3,91.9 60.7,91.9 58.9,90.1 | 58.9,90.1 43.4,74.6 43.4,69.6 | v65.5,90.2 65.9,90.6 65.9,91.9 | 154.7,39.2 154.7,39.1 | BTN6.2 BTN6.1 BTN3.2 | BTN3.2 BTN5.1 | BTN3.1 BTN3.2 | BTN5.2 BTN3.1 | BTN3.1 BTN4.2 BTN4.1 | BTN3.2 157.49,24.5 163.1,24.5 165.74,27.14 BTN2.2 | BTN2.1 BTN2.2 | BTN2.2 168.39,29.9 180.3,29.9 182.74,27.46 BTN1.2 BTN1.1 | 64.7,100.7 60.5,96.5 v59.5,96.5 | v59.6,90.1 58.9,90.1 | R12.2 41.9,108.55 41.9,100.4 42.2,100.1 52,100.1 52.6,100.7 52.6,101.7 53.3,102.4 63.2,102.4 64.7,100.9 64.7,100.7 | v104.25,65.2 102.8,63.75 v102.1,63.75
  Top 0.305: BTN6.2 154.74,39.24 154.7,39.2 | 33.4,37.6 33.4,37.54 DIS1.2
  Top 1.016: 154.7,39.2 154.7,43 | 154.7,43 152.7,45 81.4,45 77.3,40.9 35.1,40.9 33.5,39.3 33.5,37.7 33.4,37.6 | U$8.VCC 157.86,46.26 154.8,43.2 154.7,43.1 154.7,43
  Bottom 0.3: U1.14 26.64,77.86 27.3,77.2 27.85,77.2 | 27.85,77.2 R39.1 | 27.85,77.2 28.6,77.2 29,76.8 v29,74.4 | v29,74.4 29,73.9 | 29,73.9 29,72.97 L2.P$2 | R7.2 33.85,37.09 DIS1.2 | 159.85,60 R8.1 160,60.15 | IC4.1 106.1,70.48 | 106.1,70.48 106.1,70.4 | 106.1,70.48 106.1,70.5 C35.2 102.5,70.5 102.2,70.2 102.2,66.9 | 106.05,66.72 C34.2 105.9,66.8 105.8,66.7 105.78,66.72 IC4.4 | C2.1 94.3,65.1 IC3.1 95.45,65.75 R3.1 98.95,65.75 99.1,65.6 R2.1 | C1.1 C2.1 | C1.1 90.5,65.2 IC3.8 | 102.2,66.9 102.4,66.7 103.32,66.7 IC4.4 | U3.16 U3.15 100.95,59.95 101.2,59.7 | U3.16 U3.17 U3.18 99.7,61.52 99.7,62 99.78,62.08 U3.19 U3.20 | U3.10 101.25,59.65 101.2,59.7 | U3.16 98.2,60.45 C26.1 C23.1 | 102.2,66.9 102.2,71.2 101.6,71.8 98.1,71.8 96.2,69.9 96.2,68.4 95.2,67.4 94.45,67.4 C2.1 | JP3.4 52.21,61.4 50.6,61.4 49.8,62.2 49.8,63.3 49.8,64 48.56,65.24 JP3.7 | v29,74.4 29,73.9 | 101.2,59.7 101.2,59.8 102,60.6 102,61.83 U3.22 U3.23 102.25,62.95 102.05,63.15 102.05,63.7 v102.1,63.75 | 77.8,72 78.06,72 U4.17 79.69,70.41 80.5,69.6 81.31,69.6 C7.2 83.61,67.3 84.5,67.3 90.45,67.3 C1.1 | 77.8,72 74.9,72 74.23,72 | U4.27 74.23,72 | R15.2 60.39,77.3 64.6,77.3 | 64.6,77.3 65.4,77.3 | 65.4,77.3 67.7,79.6 | 67.7,79.6 68.8,79.6 69.15,79.25 C5.2 69.47,79 69.8,79 70.83,77.97 U4.38 74.23,74.71 74.23,72 | U4.5 77.8,77.8 77.8,72 | 67.7,79.6 65.4,77.3 | 65.4,77.3 64.6,77.3 | 64.6,77.3 63.5,78.4 63.5,85.9 65.5,87.9 v65.5,90.2 | SV1.18 138.31,102.2 | 162.2,68 162.2,67.5 | v59.5,96.5 59.6,96.4 v59.6,90.1 | IC4.4 104.25,65.81 v104.25,65.2
  Bottom 0.305: 28.6,77.2 28,77.2 27.9,77.3 27.9,79.1 TP1.TP
  Bottom 1: C4.1 28.23,71.4 L2.P$2 27.8,71.77 27.8,67.9 26.85,66.95 C21.+ 27.1,65.25 27.1,55.1 33.44,48.76
  Bottom 1.016: U$8.VCC 157.86,58.46 159.4,60 159.85,60 | R6.1 162.2,67.5 162.2,64.6 160,62.4 160,60.15 | 138.31,102.2 142.5,102.2 157.6,87.1 157.6,72.6 162.2,68 | 33.44,48.76 DIS1.2
AREF
  Bottom 0.3: U4.29 69.9,69.9 69.57,69.9 C8.2
DM
  Bottom 0.3: J3.D- 50.15,104.25 49.2,103.3 47.7,103.3 47.2,102.8 47.2,101.55 C11.2 47.25,100.1 R17.2
DP
  Bottom 0.3: J3.D+ 49.4,111.1 48.9,110.6 48.9,104.9 48.4,104.4 46.5,104.4 45.1,103 45.1,101.55 C12.2 45.1,101.45 45.1,100.6 44.8,100.3 R18.2
GND  (via drill 0.3)
  Top 0.3: v26.6,76.5 26.2,76.5 26.1,76.4 | R35.2 R34.2 R33.2 R32.2 R31.2 R14.2 R11.2 R10.2 | v90.2,94.1 PT1.C v90.2,94.1 | v90.2,94.1 U$5.3
  Bottom 0.3: C16.1 19.61,78.36 U1.8 U1.7 | U1.16 U1.15 23.95,77.35 U1.EXT 23.44,77.86 U1.7 | U1.16 | U1.5 U1.6 | U1.6 | U1.6 U1.7 | U1.7 | U1.16 26.24,76.86 v26.6,76.5 | U2.16 49.92,95.92 51.4,97.4 51.4,98.15 C20.2 51.55,99.7 C18.2 | 51.2,100.05 C18.2 | U2.6 49.3,87.34 C10.2 | C11.1 48.55,102.15 48.8,102.4 50.6,102.4 51.3,101.7 51.3,100.2 51.4,100.1 51.3,100 51.35,99.95 C18.2 | U4.39 71.53,78.57 70.1,80 | 70.1,80 70,80.1 | C5.1 70.14,80.04 70.1,80 | U4.28 71.51,70.41 70.5,69.4 70.5,69 69.8,68.3 | R4.1 31.85,36.55 DIS1.1 30.9,38.55 C9.- | C35.1 C33.1 107.35,67.9 | C34.1 107.35,67.9 | IC4.3 107.35,67.97 107.35,67.9 | 94.7,63.05 IC3.4 | U3.6 U3.5 U3.4 U3.3 U3.2 | C1.2 94.2,68.55 | 94.2,68.55 C2.2 | C2.2 94.55,68.55 94.6,68.6 94.3,68.6 | C2.2 94.2,68.55 | C6.1 RN2.9 | C7.1 80.72,68.23 U4.18 | JP3.10 47.85,61 48.65,60.2 49.1,60.2 55,60.2 55.8,61 56.18,61.38 JP3.2 | v90.2,94.1 89.3,95 89.3,110.1 87.14,112.26 JP1.6
  Bottom 1: B1.- 7.95,104.75 6.6,103.4 6.6,91.5 8.5,89.6 21.75,89.6 C17.- 22,89.15 22,87.3 21.7,87 C3.2 | C21.- 31.55,66.25 33.7,68.4 C4.2
  other vias: 91,59 95,59 99,67 77.7,71.15 75.6,71.15 74.5,71.15 67.25,67.95 83,92 83,89 81,89 81,92 85,92 85,89 23.15,78.15 24.25,78.15 23.15,77.6 23.7,77.05 23.7,77.6 23.7,78.15 23.15,77.05 24.25,77.05 24.25,77.6 84.55,80.15 79.3,76.95 77,78.9 74.55,79.6 72.45,77.6 78.6,77.45 77,77.3 75.25,78.85 74.05,75.95 75.15,73.75 76.65,71.15 73.45,73.75 72.6,73.75 61.45,70.8 56.95,70.85 71.85,75.4 72.5,71.45 68.1,70.7 65.2,70.5 65.25,67.5 152.2,11.3 156.85,11.5 64.95,85.85 57.7,96.5 54.3,96.5 51.4,92.6 47.8,91.9 21.8,74.1 9.6,107.4 71.65,59.75 76.95,53.25 102.15,59.45 20.15,77.05 19.45,77.05 18.75,77.05 20.05,85.45 20.05,84.75 20.05,84.05 20.05,83.35 20.05,82.65 115.9,46.5 118,43.8 154.5,45.6 156.9,42.7 152.6,42.7 69.95,59.75 73.45,59.75 84.65,66.05 83.65,66.05 87.25,65.95 87.15,68.85 87.15,70.75 84.75,68.65 81.65,53.35 67.15,66.05 68.05,66.05 62.65,62.15 68.75,82.7 68.75,81.7 68.75,80.7 72.45,75.4
  pour Top (isolate 0.305): 0,0 0,127 193,127 193,0
  pour Bottom (isolate 0.305): 0,0 205,0 205,119 205,120 0,120
N$1
  Bottom 0.3: RN2.8 145.95,6.55 147.1,5.4 173.3,5.4 187.2,19.3 187.2,20.69 BTN1.3 BTN1.4
N$2
  Top 0.3: R12.1 34.4,114.75 34.4,116.1 | 34.4,116.1 34.4,116.3 | LED1.A 34.45,116.1 34.4,116.1
N$3
  Bottom 0.3: U$6.P$2 31.6,58.57 31.87,58.3 41.4,58.3 43.2,60.1 43.2,71.3 44.4,72.5 JP2.1 | JP2.1 45.6,72.5 JP2.1
N$4
  Bottom 0.3: BTN2.4 BTN2.3 170.3,20.71 170.3,9.2 167.3,6.2 149.7,6.2 147.38,8.53 RN2.7
N$5
  Bottom 0.3: DIS1.4 38.52,40.92 SW3.9
  Bottom 0.305: SW3.9
N$6
  Bottom 0.3: C9.+ 13.25,58.05 U$6.P$1
N$7
  Bottom 0.3: DIS1.5 41.06,40.9 SW3.10
N$8
  Bottom 0.3: DIS1.15 66.46,39.99 R16.1
N$9
  Bottom 0.3: S2.1 S2.2 9.75,24.86 R38.2
N$10
  Bottom 1: D4.C 29.79,84.17 SJ1.2
N$11
  Bottom 1: J4.PWR 24,107.3 21.5,104.8 21,104.3 21,100.3 20.3,99.6 18.55,99.6 B1.AC1
N$12
  Bottom 1: 18.6,104.8 18.6,110.7 20.2,112.3 J4.GNDBREAK 23.98,116.04 J4.GND | 18.6,104.8 18.6,104.6 18.5,104.5 18.5,104.7 18.6,104.8 | 18.6,104.8 18.55,104.8 B1.AC2
N$13
  Bottom 0.3: U1.10 23.45,80.25 23.5,80.3 | U1.11 23.95,80.25 24,80.3 | 24.5,80.3 24.45,80.25 U1.12 25.2,79.09 25.2,79.1 25.2,78.38 U1.13
  Bottom 0.305: TP4.TP 25.9,89.2 25.5,88.8 25.5,88.2 25.6,88.1
  Bottom 1: C17.+ 24.25,93.95 | 24.25,93.95 25.6,95.3 | 25.6,95.3 25.6,97.86 SJ2.1 | SJ1.1 24.8,84.5 C3.1 | C3.1 24.5,86.9 25.6,88 25.6,88.1 25.6,95.3 | 24.25,93.95 25.6,95.3 | C3.1 24.5,80.3 23.5,80.3 23.91,80.3 23.95,80.25
N$14
  Bottom 0.3: BTN3.4 BTN3.3 162.2,17.81 162.2,8.5 160.7,7 151.2,7 148.41,9.79 RN2.6
N$15
  Bottom 0.3: RN2.5 149.26,11.06 151.9,13.7 151.9,16.2 153.2,17.5 157.01,17.5 BTN4.4 BTN4.3
N$16
  Bottom 0.3: DIS1.6 43.6,40.9 SW3.11
N$17
  Bottom 0.3: S1.1 S1.2 9.68,37.69 R9.2
N$18  (via drill 2)
  other vias: 100.4,37.5
N$19
  Bottom 1: B1.+ 9.5,99.1 11.1,97.5 23.6,97.5 23.9,97.8 24,97.9 SJ2.2
N$20
  Bottom 0.3: RN2.4 147.03,12.34 147.6,12.9 147.6,16.89 BTN5.4 BTN5.3
N$21
  Bottom 0.3: RN2.3 144.59,13.61 142.4,15.8 141.4,16.8 141.4,29.2 142.3,30.1 158.4,30.1 159.6,31.3 159.6,32.41 BTN6.3 BTN6.4
N$22  (via drill 2)
  other vias: 25.4,37.5
N$23
  Bottom 0.3: R13.2 174.55,54.45 175.7,55.6 175.7,56.94 U$8.LED
N$24  (via drill 0.3)
  Top 0.3: LED3.R 70.72,92.4 v72.6,92.4
  Bottom 0.3: v72.6,92.4 74.1,92.4 R21.1
N$25  (via drill 0.3)
  Top 0.3: LED3.B 68.6,95.25 v68.6,96.8
  Bottom 0.3: v68.6,96.8 68.55,96.85 R22.2
N$26
  Bottom 0.3: C14.1 52.6,89.11 U2.1
N$27
  Bottom 0.3: IC4.2 106.05,69.23 C33.2
N$28  (via drill 0.3)
  Top 0.3: LED3.G 70.7,95.2 v70.7,96.8
  Bottom 0.3: v70.7,96.8 70.65,96.65 R23.1
N$29
  Bottom 0.3: U3.8 C24.1
N$30
  Bottom 0.3: U3.9 101.75,57.45 101,56.7 101,55.85 C24.2
N$31
  Bottom 0.3: U3.7 102.75,57.75 103.7,56.8 103.7,55.85 C25.1
N$32  (via drill 2)
  other vias: 25.4,6.5
N$33
  Bottom 0.3: DIS1.11 56.3,37.7 50.6,43.4 50.6,45.02 SW3.12
N$34  (via drill 2)
  other vias: 100.4,6.5
N$35  (via drill 2)
  other vias: 152.5,109.5
N$36
  Bottom 0.3: DIS1.12 58.84,37.86 53.1,43.6 53.1,45.06 SW3.13
N$37
  Bottom 0.3: U1.9 22.93,79.37 22.4,79.9 19.45,79.9 C16.2
N$38
  Bottom 0.3: DIS1.13 61.38,38.02 55.6,43.8 55.6,45.1 SW3.14
N$39
  Bottom 0.3: DIS1.14 63.92,37.68 58.1,43.5 58.1,45.14 SW3.15
N$40
  Bottom 0.3: SW3.16 60.59,44.16 R16.2
N$41
  Top 0.3: LED4.A 124.5,4.4 120.5,8.4 120.5,13.2 SW1.9
N$42
  Top 0.3: LED6.A 125.5,14.4 121.7,18.2 120.6,18.2 SW1.11
N$43
  Top 0.3: SW1.13 123.47,23.37 124.5,24.4 LED8.A
N$44
  Top 0.3: SW1.15 121.45,28.45 125.4,32.4 125.4,34.25 LED10.A
N$45
  Top 0.3: LED11.A 123.5,39.4 120.51,36.41 120.51,31.51 SW1.16
  Top 0.305: SW1.16
N$46
  Top 0.3: SW1.14 122.06,25.91 LED9.A
N$47
  Top 0.3: LED7.A 125.3,19.4 123.9,20.8 120.54,20.8 SW1.12
N$48
  Top 0.3: LED5.A 125.55,11.35 121.1,15.8 120.56,15.8 SW1.10
N$49
  Top 0.3: R10.1 LED4.C
N$50
  Top 0.3: R11.1 LED5.C
N$51
  Top 0.3: R14.1 LED6.C
N$52
  Top 0.3: LED7.C R31.1
N$53
  Top 0.305: LED8.C R32.1
N$54
  Top 0.3: LED9.C R33.1
N$55
  Top 0.3: LED10.C R34.1
N$56
  Top 0.3: LED11.C R35.1
N$57
  Bottom 0.3: C10.1 51.26,87.11 U2.3 51.26,90.64 51.2,90.7 48.62,93.28 U2.14 U2.13
N$58
  Bottom 0.3: U2.12 47.33,97.97 R17.1
N$59
  Bottom 0.3: U2.11 46.67,95.62 44.8,97.5 R18.1
N$60
  Top 0.3: R36.2 LED2.A
N$61
  Top 0.3: LED12.A R37.2
N$62  (via drill 2)
  other vias: 181,109.5
N$63  (via drill 2)
  other vias: 181,57.5
N$64  (via drill 2)
  other vias: 152.5,57.5
N$65
  Bottom 0.3: U1.3 23.45,75.15 23.5,75.2 | U1.2 23.95,75.15 24.1,75.2 | U1.1 24.45,75.15 24.5,75.2
  Bottom 0.5: 23.97,75.03 24.1,75.2
  Bottom 0.7: 24.1,75.2 23.5,75.2 24.1,75.2 | 24.1,75.2 24.5,75.2
  Bottom 1: L2.P$1 23.97,75.03
N$66  (via drill 3)
  other vias: 5,115
N$67  (via drill 0.3)
  Top 0.3: v21.6,75.3 v26.6,75.3
  Bottom 0.3: U1.4 22.37,76.07 v21.6,75.3 | v26.6,75.3 27.25,75.3 R39.2
  Bottom 0.305: v21.6,75.3 TP2.TP | TP2.TP 19.9,75.3 20.4,75.2 TP2.TP
N$68  (via drill 3)  (1 unrouted)
  other vias: 5,5 115,65
N$69  (via drill 3)
  other vias: 188,115
N$70  (via drill 3)
  other vias: 188,5
PA0  (via drill 0.3)
  Top 0.3: v71.5,76.3 71,76.8 71,79.4 73.4,81.8 76.7,81.8 81.6,76.9 85.6,76.9 95.1,86.4 95.1,94.1 96.04,95.04 U$5.2
  Bottom 0.3: U4.37 v71.5,76.3
PA1  (via drill 0.3)
  Top 0.3: R1.2 PT1.A | PT1.A 86.1,94.1 PT1.A | v68.3,77.9 73.1,82.7 77.2,82.7 82.2,77.7 85.3,77.7 85.95,78.35 PT1.A
  Bottom 0.3: U4.36 68.78,77.9 | 68.78,77.9 v68.3,77.9 68.78,77.9
PA2  (via drill 0.3)
  Top 0.3: 159.9,74.3 90.3,74.3 90,74.6 71.5,74.6 70.85,75.25 70.25,75.25 | 159.9,74.3 v160,74.3 | v160,74.3 160.1,74.3 | v160,74.3 159.9,74.3
  Top 0.305: 70.25,75.25 v70.25,75.3
  Bottom 0.3: U$8.SD_CS 162.2,109.6 R6.2 160.15,107.45 160,107.3 160,75.6 v160,74.3 | U4.35 70.33,75.2 v70.25,75.3
PA5  (via drill 0.3)
  Top 0.3: 61.6,57.7 58.6,57.7 57.6,58.7 57.6,61.5 57.6,61.7 63.1,67.2 v63.1,71.5
  Top 0.305: 61.6,57.7 69.3,57.7 70.8,56.2 v70.8,54.7 70.9,54.6
  Bottom 0.3: C6.2 136.6,8.7 | 136.6,8.7 136.6,12.7 | 136.6,12.7 137.6,13.7 139.16,13.7 RN2.14 | 136.6,12.7 136.6,8.7 | 136.6,8.7 136.4,8.5 116.1,8.5 109.2,8.5 86.4,31.3 86.4,52.1 83.8,54.7 v70.8,54.7 | v63.1,71.5 64.5,71.5 68,71.5 69.17,72.67 U4.32
PA6  (via drill 0.3)
  Top 0.3: 83,73.1 83.1,73.1 | 83.1,73.1 v88.4,73.1 | v88.4,70.5 v88.4,62.6 | v70.9,73.1 71.75,72.25 81.95,72.25 82.8,73.1 83.1,73.1
  Bottom 0.3: R5.1 90.5,63.05 IC3.5 88.95,63.15 v88.4,62.6 | U4.31 70.84,73.1 v70.9,73.1 | v88.4,73.1 v88.4,70.5
PA7  (via drill 0.3)
  Top 0.3: v69,70.4 69.9,69.5 71.4,69.5 80.8,69.5 83.8,72.5 86.9,72.5 87.3,72.1 90.8,72.1 91.6,72.9 91.7,72.9 142.6,72.9 164.5,72.9 174.4,63 174.4,56.3 v174.4,52.7
  Bottom 0.3: U4.30 69.55,70.7 | v174.4,52.7 173,52.7 172.85,52.85 R13.1 | v69,70.4 69.3,70.7 69.5,70.7
  Bottom 0.305: 69.5,70.7 69.55,70.7
PB0  (via drill 0.3)
  Top 0.3: v73.7,77.3 75.6,75.4 v163.7,75.4
  Bottom 0.3: U$8.CS 162.94,59.06 161.8,60.2 161.3,60.2 | 161.3,60.2 161.2,60.2 | R8.2 161.25,60.15 161.3,60.2 | U4.40 73.47,77.7 73.5,77.7 73.7,77.5 v73.7,77.3
  Bottom 0.305: v163.7,75.4 163.7,59.8 163,59.1 162.96,59.06 162.94,59.06
PB1  (via drill 0.3)
  Top 0.3: v74.6,78.1 76,76.7 76.5,76.2 77.4,76.2 161.6,76.2 162.1,76.7 164.2,76.7 v164.3,76.7
  Bottom 0.3: U4.41 74.2,78.12 74.2,78.1 v74.6,78.1 | v164.3,76.7 165.48,75.52 U$8.RESET
PB2  (via drill 0.3)
  Top 0.3: v84.8,51 81.8,51 74.3,58.5 58.8,58.5 58.3,59 58.3,61.2 64.2,67.1 64.2,67.3 | v64.4,83.6 64.2,83.4 64.2,67.9 | 64.2,67.9 64.2,67.3 | 64.2,67.3 64.2,67.9
  Bottom 0.3: S2.3 S2.4 18.41,29 72.3,29 84.8,41.5 v84.8,51 | U4.42 71.94,81.5 69.83,83.6 v64.4,83.6
PB3
  Bottom 0.3: R22.1 66.8,97.65 66.8,89.5 | 66.8,89.5 66.8,88.9 | U4.43 66.8,87.78 66.8,89.5
PB4  (via drill 0.3)
  Top 0.3: v76.2,73.7 76.5,74 80.7,74 89.4,74 89.8,73.6 v89.9,73.6 | v160,65 168,57 U$8.A0
  Bottom 0.3: 74.2,83.7 74.2,81.5 U4.44 76.2,79.5 v76.2,73.7 | v89.9,73.6 142.9,73.6 151.5,65 v160,65
PB5  (via drill 0.3)
  Top 0.3: JP1.4 83.86,113.5 88.6,113.5 90.2,111.9 91.8,111.9 v92.3,111.9
  Bottom 0.3: U$8.SDA 170.56,103.54 165.4,108.7 165.4,110.26 | 165.4,110.26 U$8.SD_MOSI | U4.1 76.8,81.38 76.8,110.3 76.8,113.3 78.3,114.8 81.1,114.8 82.62,113.28 JP1.4 | 165.4,110.26 163.76,111.9 93,111.9 v92.3,111.9
PB6  (via drill 0.3)
  Top 0.3: v90.5,110.6 87.5,107.6 81,107.6 80.08,108.52 JP1.1
  Bottom 0.3: U4.2 78.1,81.51 78.1,82.3 77.9,82.5 77.9,107.8 79.82,109.72 JP1.1 | U$8.SD_MISO 165.06,113.3 163.1,113.3 91.3,113.3 90.5,112.5 v90.5,110.6
PB7  (via drill 0.3)
  Top 0.3: v91.7,114.4 82,114.4 81.4,113.8 81.4,111.2 82.62,109.98 JP1.3
  Bottom 0.3: U$8.SCK 172,58.1 172,104.1 170.56,105.54 U$8.SD_SCK 166.5,114.4 v91.7,114.4 | U4.3 78.8,81.06 78.8,84.3 78.8,105.5 82.62,109.32 JP1.3
PC0  (via drill 0.3)
  Top 0.3: v59.6,60.4 66.3,67.1 77.3,67.1 77.8,66.6 v81.2,66.6
  Bottom 0.3: U4.19 v81.2,66.6 81.5,66.3 83.35,64.45 IC3.7 92.15,64.45 92.2,64.4 93.4,63.2 93.4,55.8 93.8,55.4 95.5,53.7 96.3,53.7 106.2,53.7 106.3,53.6 106.8,53.1 115.1,44.8 117.7,42.2 118.2,41.7 118.2,41.6 118.2,13.5 117.91,13.21 SW1.8 | SW3.8 42.9,52.9 42.9,54.3 47.8,59.2 58.4,59.2 v59.6,60.4
PC1  (via drill 0.3)
  Top 0.3: v61.8,61.2 61.9,61.1 v84.2,61.1
  Bottom 0.3: U4.20 77.98,68.72 80.5,66.2 82.9,63.8 86.6,63.8 | 86.6,63.8 IC3.6 91.9,63.8 92.7,63 92.7,55.6 95.4,52.9 105.9,52.9 117.5,41.3 117.5,16.7 116.5,15.7 112.94,15.7 SW1.7 | SW3.7 45.3,52.86 45.3,54.3 49.4,58.4 59,58.4 v61.8,61.2 | v84.2,61.1 86.6,63.5 86.6,63.8
PC2  (via drill 0.3)
  Top 0.3: v63.6,61.9 63.65,61.95 v81.95,61.95
  Bottom 0.3: 77.45,68.15 U4.21 78.2,67.33 78.2,65.7 v81.95,61.95 | SW1.6 116.19,18.29 116.8,18.9 116.8,40.9 105.6,52.1 95.3,52.1 92.1,55.3 89,58.4 85.5,58.4 82.1,61.8 | 82.1,61.8 v81.95,61.95 | SW3.6 47.9,54.1 51.5,57.7 59.4,57.7 v63.6,61.9 63.6,62.7 61,65.3 56.25,65.3 JP3.1 | v81.95,61.95 82.1,61.8
PC3  (via drill 0.3)
  Top 0.3: v66,63.1 66.05,63.05 v79.35,63.05
  Bottom 0.3: 76.59,67.59 U4.22 76.5,67.27 76.5,65.9 79.2,63.2 | SW1.5 115.73,20.83 116.1,21.2 116.1,40.4 105.2,51.3 95.2,51.3 91.5,55 88.7,57.8 84.6,57.8 v79.35,63.05 | v79.35,63.05 79.2,63.2 | SW3.5 50.5,52.88 50.5,54.3 53.2,57 59.9,57 v66,63.1 64.7,63.1 60.5,67.3 55.7,67.3 54.9,66.5 54.9,64.5 54.5,64.1 52.1,64.1 51.9,64.1 51.1,64.9 JP3.5 | v79.35,63.05 79.2,63.2
PC4  (via drill 0.3)
  Top 0.3: v67.9,64.1 67.95,64.15 v76.55,64.15
  Bottom 0.3: 74.29,67.59 U4.23 74.5,67.6 74.3,67.4 74.3,66.4 v76.55,64.15 | SW1.4 115.17,23.37 115.3,23.5 115.4,23.6 115.4,39.9 105.6,49.7 104.8,50.5 95.1,50.5 90.9,54.7 88.4,57.2 83.5,57.2 76.7,64 | 76.7,64 v76.55,64.15 | SW3.4 53,52.84 53,54.3 55,56.3 60.4,56.3 67.9,63.8 v67.9,64.1 65.7,64.1 61.3,68.5 56.3,68.5 55.3,68.5 53.6,66.8 53.6,65.41 JP3.3 | v76.55,64.15 76.7,64
PC5  (via drill 0.3)
  Top 0.3: v69,65.2 69.05,65.25 v73.45,65.25
  Bottom 0.3: 73.75,68.15 U4.24 73.8,68 73.7,68.1 | SW1.3 114.51,25.91 114.7,26.1 114.7,39.3 114.7,39.4 114.1,40 106.5,47.6 104.4,49.7 104.3,49.7 95,49.7 94.9,49.8 93.4,51.3 90.3,54.4 88.2,56.5 88.1,56.6 82.1,56.6 v73.45,65.25 | v73.45,65.25 73.25,65.45 | 73.25,65.45 72.9,65.8 72.9,67.3 73.7,68.1 | 73.7,68.1 73.8,68.2 73.7,68.1 | v73.45,65.25 73.25,65.45 | SW3.3 55.5,54.4 56.7,55.6 60.9,55.6 69,63.7 69,65 | v69,65.2 65.9,65.2 63.5,67.6 61.9,69.2 61.7,69.2 48.1,69.2 46,67.1 46,65.39 JP3.9
  Bottom 0.305: 69,65 v69,65.2
PC6  (via drill 0.3)
  Top 0.3: v70.1,66.2 70.3,66.2 v71.8,66.2
  Bottom 0.3: U4.25 72.35,67.85 71.8,67.3 v71.8,66.2 71.8,65.5 81.2,56.1 81.3,56 82.1,56 87.8,56 87.9,55.9 89.7,54.1 89.8,54 93.9,49.9 94.9,48.9 95.2,48.9 104,48.9 104.1,48.8 104.2,48.7 104.4,48.5 112.9,40 114,38.9 114,38.7 114,28.8 113.65,28.45 SW1.2 | 70.1,64.86 70.1,64.9 | 70.1,64.9 v70.1,66.2 | SW3.2 58.1,52.86 58.1,54.4 58.6,54.9 61.4,54.9 70.1,63.6 70.1,64.9
PC7
  Bottom 0.3: U4.26 72.66,69.26 71.4,68 71,67.6 71,65.4 | 71,65.4 71,65 80.6,55.4 87.5,55.4 87.6,55.3 89.4,53.5 94.8,48.1 95,48.1 103.6,48.1 103.7,48 104,47.7 104.3,47.4 106.2,45.5 111.6,40.1 113.3,38.4 113.3,38.1 113.3,31.5 112.7,30.9 112.4,30.9 112.39,30.91 SW1.1 | SW3.1 71,63.22 71,65.4
PD0  (via drill 0.3)
  Top 0.3: v54,94.4 59.7,94.4 65.2,99.9 73.6,99.9 79.6,93.9 79.6,83.1 | 79.6,83 v83.4,79.2 | 79.6,83.1 79.6,83 | 79.6,83 79.6,83.1
  Bottom 0.3: U2.20 53.96,94.44 v54,94.4 | v83.4,79.2 83.4,78.91 U4.9
PD1  (via drill 0.3)
  Top 0.3: v49.3,90.9 54.8,90.9 57.7,90.9 65.7,98.9 73,98.9 78.4,93.5 78.4,82.7 78.9,82.2 82.7,78.4 84,78.4 84.2,78.6 v84.3,78.6
  Bottom 0.3: U2.4 50.6,90.19 49.9,90.9 v49.3,90.9 | v84.3,78.6 83.34,77.7 U4.10
PD2
  Bottom 0.3: U4.11 83.06,76.3 90.9,76.3 123,76.3 132.2,85.5 132.2,100.3 132.8,100.9 135.6,100.9 136.9,100.9 138.18,99.62 SV1.16
PD3
  Bottom 0.3: SV1.14 137.05,98.3 135,98.3 133.8,98.3 133.1,97.6 133.1,85.2 123.3,75.4 87.2,75.4 84.9,75.4 82.73,73.23 U4.12
PD4  (via drill 0.3)
  Top 0.3: v79.3,73.3 78.9,72.9 75,72.9 72.3,72.9 70.8,74.4 v68.4,74.4
  Bottom 0.3: U4.13 81.28,73.3 v79.3,73.3 | v68.4,74.4 66.5,72.5 JP2.2 48,72.5
  Bottom 0.305: 48,72.5 JP2.2
PD5  (via drill 0.3)
  Top 0.3: v85.9,71.9 84.5,70.5 83.2,70.5 81.4,68.7 69,68.7 67.3,70.4 67.3,84.7 68.7,86.1 72,86.1 74.2,88.3 v74.2,89.5
  Bottom 0.3: v74.2,89.5 74.1,89.6 R21.2 | U4.14 81.94,71.5 85.2,71.5 85.6,71.9 v85.9,71.9
PD6  (via drill 0.3)
  Top 0.3: v83.4,52.6 83.4,53.1 86.1,55.8 86.1,70.1 85.8,70.4 v85.7,70.4
  Bottom 0.3: S1.3 S1.4 12.8,36.21 12.8,29.6 13.4,30.2 71.6,30.2 83.4,42 v83.4,52.6 | v85.7,70.4 85.6,70.4 | 85.6,70.4 85.5,70.4 | U4.15 80.86,71.54 81.5,70.9 82.5,70.9 84.9,70.9 85.4,70.4 85.6,70.4
PD7  (via drill 0.3)
  Top 0.3: v83.7,69.4 82.1,67.8 74.3,67.8 68.6,67.8 66.3,70.1 66.3,85.2 68.1,87 v70.6,87
  Bottom 0.3: R23.2 72.4,97.65 72.4,95 70.6,93.2 v70.6,87 | U4.16 80.57,70.6 80.7,70.6 81.1,70.2 82.8,70.2 83.6,69.4 v83.7,69.4
RESET
  Top 0.3: JP3.6 49.8,64.13 49.8,67 57.34,74.54 S3.4 S3.3
  Bottom 0.3: U4.4 79.8,80.95 79.8,104.7 83.2,108.1 84.8,108.1 85.16,108.46 JP1.5 85.16,109.74 83.9,111 83.9,115.1 83.1,115.9 77.9,115.9 75.4,113.4 75.4,109.4 65.5,99.5 65.5,93.5 59.1,87.1 59.1,77.31 R15.1 57.34,78.94 S3.4 | C14.2 52.8,85.55 S3.3
RXLED  (via drill 0.3)
  Top 0.3: v53.9,101 55.95,101 LED12.C
  Bottom 0.3: U2.17 50.58,95.38 53.5,98.3 53.5,100.6 v53.9,101
SCL  (via drill 0.3)
  Top 0.3: v98.9,70.4 97.6,69.1 v97.6,64.7 v101,64.7
  Bottom 0.3: IC3.2 R3.2 | R3.2 96.6,64.4 | R3.2 97.35,64.45 v97.6,64.7 | v98.9,70.4 100.98,70.4 IC4.8 | U3.21 101.25,64.45 v101,64.7
SDA
  Bottom 0.3: IC3.3 95.6,63.8 95.7,63.7 99.05,63.7 R2.2 99.15,63.6 99.6,63.6 100,64 100,65.7 | IC4.7 100.33,69.23 100,68.9 100,65.7 | U3.24 102.75,64.45 101.7,65.5 100.2,65.5 100,65.7
TXLED  (via drill 0.3)
  Top 0.3: LED2.C 48.8,99.3 46.6,97.1 v46.6,87.6
  Bottom 0.3: v46.6,87.6 46.6,89.06 U2.10
VO
  Bottom 0.3: R4.2 34.7,33.9 35.2,34.4 35.2,35.35 R7.1 35.15,36.67 DIS1.3
VUSB  (via drill 0.3)
  Top 0.3: R37.1 R36.1 | v50.1,101 50.1,103 47.63,105.47 47.63,109.07 | 47.63,109.07 47.6,109.1 | 47.63,109.07 47.63,109.1 J3.VBUS
  Top 0.305: R36.1 60.2,99.3 60.2,98.7 60.2,98.5 60,98.3 51.1,98.3 v49.3,96.5
  Bottom 0.3: U2.15 49.27,96.78 49.9,97.4 49.9,98.25 C20.1 49.85,98.85 50.1,99.1 50.1,99.85 C18.1 50.1,99.95 v50.1,101
  Bottom 0.305: 49.3,96.4 v49.3,96.5 49.27,96.53 49.27,96.78
  Bottom 1: D4.A 33.7,99.1 43.7,109.1 47.63,109.1 J3.VBUS
XTAL1
  Bottom 0.3: U4.8 80.8,77.4 82.4,79 82.4,80.1 81.9,80.6 81.9,81.3 84.4,83.8 86.1,83.8 86.15,83.85 | 86.15,83.85 86.3,84 | C15.2 86.5,83.65 Y1.1 86.2,83.9 86.15,83.85
XTAL2
  Bottom 0.3: U4.7 80.2,78 81.4,79.2 81.4,80 80.8,80.6 80.8,81.81 Y1.3 81.63,83.29 C13.2

### Text on the board
Bottom: 2018 | DT | Vin | 3.3V | GND | PG
_tsilk: POWER | ISP | USB | Rx | Tx | LIGHT | PM | TEMP | RGB LED | ESP32 | RESET | SPK | JTAG | LCD | PC7 | LEDS | PC6 | PC5 | BTN6 | PD6 | PC4 | PC3 | BTN5 | BTN3 | BTN2 | BTN1 | PC2 | PB2 | PC1 | BTN4 | PC0
215bmp: D:/Downloads/logo.bmp